# EAGLE design sbc_245 (EAGLE 9.2.0)

## Sheet 1 of 3
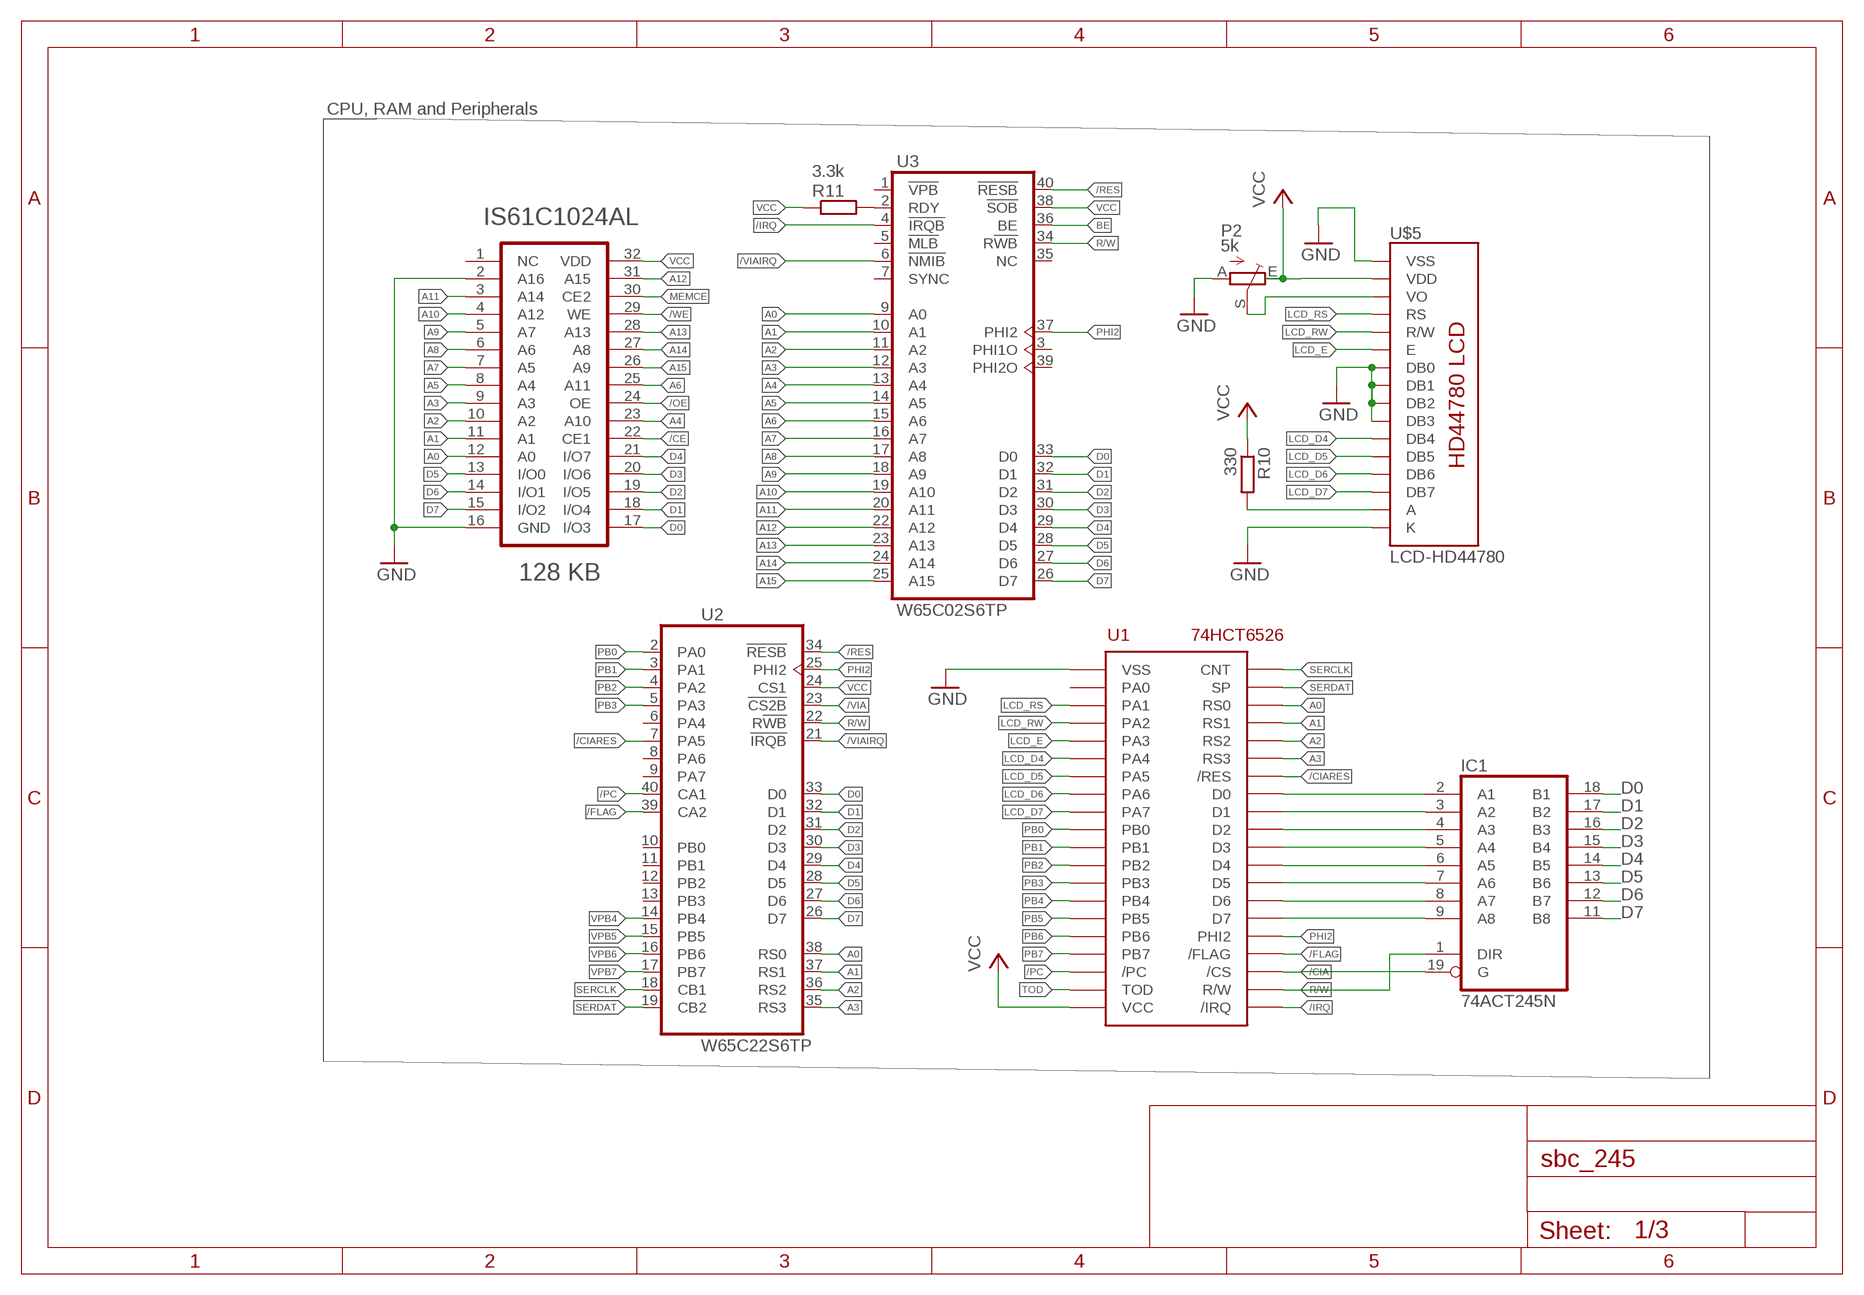
[diagram p0: schematic, sheet 1]

### Parts
IC1  74ACT245N  [DIL20]
P2  5k  TRIM_EU-B64Y  [B64Y]
R10  330  R-EU_R0805  [R0805]
R11  3.3k  R-EU_R0805  [R0805]
U1  74HCT6526  CIA40CIA_DIP  [DIP40]
U2  W65C22S6TP  [DIL40]
U3  W65C02S6TP  [DIL40]
U4  IS61C1024AL-12JLI-TR  IS61C1024AL  [SOJ32/3]
U$5  LCD-HD44780  [LCD-20X4-4HOLES2X8]

### Nets
/CE: U4.22(CE1) ; also sheet 2
/CIA: IC1.19(G) U1.23(/CS) ; also sheet 3
/CIARES: U1.34(/RES) U2.7(VIA:PA5)
/FLAG: U1.24(/FLAG) U2.39(VIA:CA2)
/IRQ: U1.21(/IRQ) U3.4(1:!IRQB)
/OE: U4.24(OE) ; also sheet 3
/PC: U1.18(/PC) U2.40(VIA:CA1)
/RES: U2.34(VIA:!RESB) U3.40(1:!RESB) ; also sheet 3
/VIA: U2.23(VIA:!CS2B) ; also sheet 3
/VIAIRQ: U2.21(VIA:!IRQB) U3.6(1:!NMIB)
/WE: U4.29(WE) ; also sheet 3
A0: U1.38(RS0) U2.38(VIA:RS0) U3.9(1:A0) U4.12(A0) ; also sheet 2
A1: U1.37(RS1) U2.37(VIA:RS1) U3.10(1:A1) U4.11(A1) ; also sheet 2
A2: U1.36(RS2) U2.36(VIA:RS2) U3.11(1:A2) U4.10(A2) ; also sheet 2
A3: U1.35(RS3) U2.35(VIA:RS3) U3.12(1:A3) U4.9(A3) ; also sheet 2
A4: U3.13(1:A4) U4.23(A10) ; also sheet 2
A5: U3.14(1:A5) U4.8(A4) ; also sheet 2
A6: U3.15(1:A6) U4.25(A11) ; also sheet 2
A7: U3.16(1:A7) U4.7(A5) ; also sheet 2
A8: U3.17(1:A8) U4.6(A6) ; also sheet 2
A9: U3.18(1:A9) U4.5(A7) ; also sheet 2
A10: U3.19(1:A10) U4.4(A12) ; also sheet 2
A11: U3.20(1:A11) U4.3(A14) ; also sheet 2,3
A12: U3.22(1:A12) U4.31(A15) ; also sheet 2,3
A13: U3.23(1:A13) U4.28(A13) ; also sheet 2,3
A14: U3.24(1:A14) U4.27(A8) ; also sheet 2,3
A15: U3.25(1:A15) U4.26(A9) ; also sheet 2,3
BE: U3.36(1:BE) ; also sheet 2
D0: IC1.18(B1) U2.33(VIA:D0) U3.33(1:D0) U4.17(I/O3) ; also sheet 2
D1: IC1.17(B2) U2.32(VIA:D1) U3.32(1:D1) U4.18(I/O4) ; also sheet 2
D2: IC1.16(B3) U2.31(VIA:D2) U3.31(1:D2) U4.19(I/O5) ; also sheet 2
D3: IC1.15(B4) U2.30(VIA:D3) U3.30(1:D3) U4.20(I/O6) ; also sheet 2
D4: IC1.14(B5) U2.29(VIA:D4) U3.29(1:D4) U4.21(I/O7) ; also sheet 2
D5: IC1.13(B6) U2.28(VIA:D5) U3.28(1:D5) U4.13(I/O0) ; also sheet 2
D6: IC1.12(B7) U2.27(VIA:D6) U3.27(1:D6) U4.14(I/O1) ; also sheet 2
D7: IC1.11(B8) U2.26(VIA:D7) U3.26(1:D7) U4.15(I/O2) ; also sheet 2
GND [power]: P2.A U1.1(VSS) U4.2(A16) U4.16(GND) U$5.P$1(VSS) U$5.P$7(DB0) U$5.P$8(DB1) U$5.P$9(DB2) U$5.P$10(DB3) U$5.P$16(K) ; also sheet 2,3
LCD_D4: U1.6(PA4) U$5.P$11(DB4)
LCD_D5: U1.7(PA5) U$5.P$12(DB5)
LCD_D6: U1.8(PA6) U$5.P$13(DB6)
LCD_D7: U1.9(PA7) U$5.P$14(DB7)
LCD_E: U1.5(PA3) U$5.P$6(E)
LCD_RS: U1.3(PA1) U$5.P$4(RS)
LCD_RW: U1.4(PA2) U$5.P$5(R/W)
LCDA: R10.2 U$5.P$15(A)
MEMCE: U4.30(CE2) ; also sheet 3
N$3: IC1.2(A1) U1.33(D0)
N$5: IC1.3(A2) U1.32(D1)
N$6: IC1.4(A3) U1.31(D2)
N$7: IC1.5(A4) U1.30(D3)
N$8: IC1.6(A5) U1.29(D4)
N$21: P2.S U$5.P$3(VO)
N$22: IC1.7(A6) U1.28(D5)
N$23: IC1.8(A7) U1.27(D6)
N$24: R11.2 U3.2(1:RDY)
N$27: IC1.9(A8) U1.26(D7)
PB0: U1.10(PB0) U2.2(VIA:PA0) ; also sheet 2
PB1: U1.11(PB1) U2.3(VIA:PA1) ; also sheet 2
PB2: U1.12(PB2) U2.4(VIA:PA2) ; also sheet 2
PB3: U1.13(PB3) U2.5(VIA:PA3) ; also sheet 2
PB4: U1.14(PB4) ; also sheet 2
PB5: U1.15(PB5) ; also sheet 2
PB6: U1.16(PB6) ; also sheet 2
PB7: U1.17(PB7) ; also sheet 2
PHI2: U1.25(PHI2) U2.25(VIA:PHI2) U3.37(1:PHI2) ; also sheet 2,3
R/W: IC1.1(DIR) U1.22(R/W) U2.22(VIA:R!WB) U3.34(1:R!WB) ; also sheet 2,3
SERCLK: U1.40(CNT) U2.18(VIA:CB1)
SERDAT: U1.39(SP) U2.19(VIA:CB2)
TOD: U1.19(TOD) ; also sheet 2
VCC [power]: P2.E R10.1 R11.1 U1.20(VCC) U2.24(VIA:CS1) U3.38(1:!SOB) U4.32(VDD) U$5.P$2(VDD) ; also sheet 2,3
VPB4: U2.14(VIA:PB4) ; also sheet 2
VPB5: U2.15(VIA:PB5) ; also sheet 2
VPB6: U2.16(VIA:PB6) ; also sheet 2
VPB7: U2.17(VIA:PB7) ; also sheet 2
Unconnected: U1.2(PA0) U2.6(VIA:PA4) U2.8(VIA:PA6) U2.9(VIA:PA7) U2.10(VIA:PB0) U2.11(VIA:PB1) U2.12(VIA:PB2) U2.13(VIA:PB3) U3.1(1:!VPB) U3.3(1:PHI1O) U3.5(1:!MLB) U3.7(1:SYNC) U3.35(1:NC) U3.39(1:PHI2O) U4.1(NC)

### Notes on the sheet
- CPU, RAM and Peripherals

## Sheet 2 of 3: Arduino Bootstrap
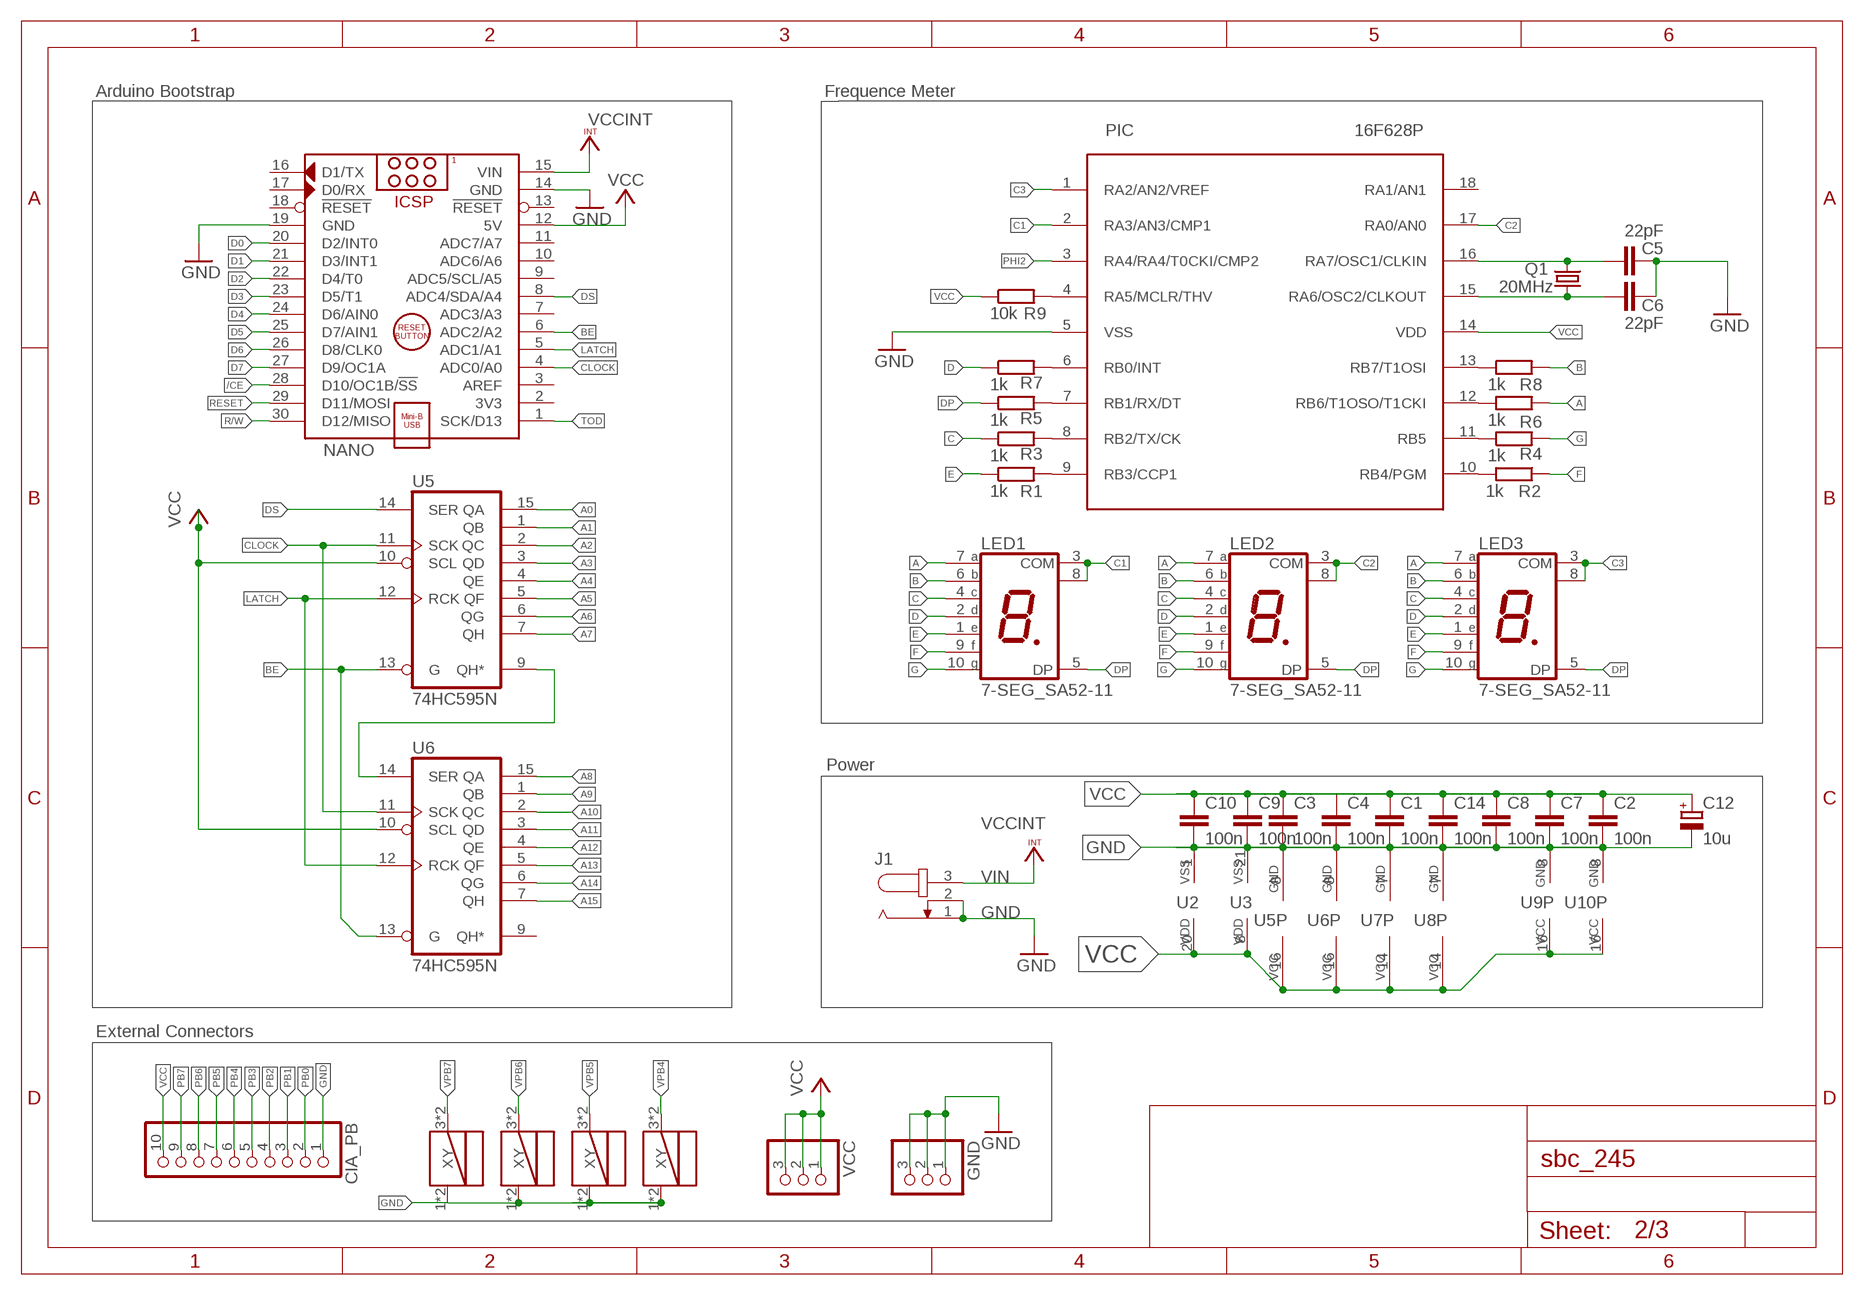
[diagram p1: schematic, sheet 2]

### Parts
C1  100n  C-EUC0805  [C0805]
C2  100n  C-EUC0805  [C0805]
C3  100n  C-EUC0805  [C0805]
C4  100n  C-EUC0805  [C0805]
C5  22pF  C-EU025-025X050  [C025-025X050]
C6  22pF  C-EU025-025X050  [C025-025X050]
C7  100n  C-EUC0805  [C0805]
C8  100n  C-EUC0805  [C0805]
C9  100n  C-EUC0805  [C0805]
C10  100n  C-EUC0805  [C0805]
C12  10u  CPOL-EUB45181A  [B45181A]
C14  100n  C-EUC0805  [C0805]
CIA_PB  PINHD-1X10  [1X10]
GND  PINHD-1X3  [1X03]
J1  JACK-PLUG0  [SPC4077]
LED1  7-SEG_SA52-11  [SA52-11]
LED2  7-SEG_SA52-11  [SA52-11]
LED3  7-SEG_SA52-11  [SA52-11]
NANO  ARDUINO_NANO  [ARDUINO_NANO]
PIC  16F628P  [DIL18]
Q1  20MHz  CRYSTALHC18U-V  [HC18U-V]
R1  1k  R-EU_0207/7  [0207/7]
R2  1k  R-EU_0207/7  [0207/7]
R3  1k  R-EU_0207/7  [0207/7]
R4  1k  R-EU_0207/7  [0207/7]
R5  1k  R-EU_0207/7  [0207/7]
R6  1k  R-EU_0207/7  [0207/7]
R7  1k  R-EU_0207/7  [0207/7]
R8  1k  R-EU_0207/7  [0207/7]
R9  10k  R-EU_R0805  [R0805]
U5  74HC595N  74LS595D  [SO16]
U6  74HC595N  74LS595D  [SO16]
U7  74AC74D  74LS74D  [SO14]
U8  74AC14D  7414D  [SO14]
U9  74AC139D  [SO16]
U10  74AC138D  [SO16]
U$1  TSA451G90-250  [TSA451G90-250]
U$2  TSA451G90-250  [TSA451G90-250]
U$3  TSA451G90-250  [TSA451G90-250]
U$4  TSA451G90-250  [TSA451G90-250]
VCC  PINHD-1X3  [1X03]

### Nets
/CE: NANO.28(D10/OC1B/!SS) ; also sheet 1
A [pic]: LED1.7(A) LED2.7(A) LED3.7(A) R6.2
A0: U5.15(QA) ; also sheet 1
A1: U5.1(QB) ; also sheet 1
A2: U5.2(QC) ; also sheet 1
A3: U5.3(QD) ; also sheet 1
A4: U5.4(QE) ; also sheet 1
A5: U5.5(QF) ; also sheet 1
A6: U5.6(QG) ; also sheet 1
A7: U5.7(QH) ; also sheet 1
A8: U6.15(QA) ; also sheet 1
A9: U6.1(QB) ; also sheet 1
A10: U6.2(QC) ; also sheet 1
A11: U6.3(QD) ; also sheet 1,3
A12: U6.4(QE) ; also sheet 1,3
A13: U6.5(QF) ; also sheet 1,3
A14: U6.6(QG) ; also sheet 1,3
A15: U6.7(QH) ; also sheet 1,3
B [pic]: LED1.6(B) LED2.6(B) LED3.6(B) R8.2
BE: NANO.6(ADC2/A2) U5.13(G) U6.13(G) ; also sheet 1
C [pic]: LED1.4(C) LED2.4(C) LED3.4(C) R3.1
C1 [pic]: LED1.3(COM) LED1.8(COM) PIC.2(RA3/AN3/CMP1)
C2 [pic]: LED2.3(COM) LED2.8(COM) PIC.17(RA0/AN0)
C3 [pic]: LED3.3(COM) LED3.8(COM) PIC.1(RA2/AN2/VREF)
CLOCK: NANO.4(ADC0/A0) U5.11(SCK) U6.11(SCK)
D [pic]: LED1.2(D) LED2.2(D) LED3.2(D) R7.1
D0: NANO.20(D2/INT0) ; also sheet 1
D1: NANO.21(D3/INT1) ; also sheet 1
D2: NANO.22(D4/T0) ; also sheet 1
D3: NANO.23(D5/T1) ; also sheet 1
D4: NANO.24(D6/AIN0) ; also sheet 1
D5: NANO.25(D7/AIN1) ; also sheet 1
D6: NANO.26(D8/CLK0) ; also sheet 1
D7: NANO.27(D9/OC1A) ; also sheet 1
DP [pic]: LED1.5(DP) LED2.5(DP) LED3.5(DP) R5.1
DS: NANO.8(ADC4/SDA/A4) U5.14(SER)
E [pic]: LED1.1(E) LED2.1(E) LED3.1(E) R1.1
F [pic]: LED1.9(F) LED2.9(F) LED3.9(F) R2.1
G [pic]: LED1.10(G) LED2.10(G) LED3.10(G) R4.2
GND [power]: C1.2 C2.2 C3.2 C4.2 C5.2 C6.2 C7.2 C8.2 C9.2 C10.2 C12.- C14.2 CIA_PB.1 GND.1 GND.2 GND.3 J1.1 J1.2 NANO.14(GND) NANO.19(GND) PIC.5(VSS) U2.1(VIAP:VSS) U3.21(P:VSS) U5.8(GND) U6.8(GND) U7.7(P:GND) U8.7(P:GND) U9.8(P:GND) U10.8(GND) U$1.1(X) U$1.2(X) U$2.1(X) U$2.2(X) U$3.1(X) U$3.2(X) U$4.1(X) U$4.2(X) ; also sheet 1,3
LATCH: NANO.5(ADC1/A1) U5.12(RCK) U6.12(RCK)
N$9: U5.9(QH*) U6.14(SER)
N$10: PIC.6(RB0/INT) R7.2
N$11: PIC.7(RB1/RX/DT) R5.2
N$12: PIC.8(RB2/TX/CK) R3.2
N$13: PIC.9(RB3/CCP1) R1.2
N$14: PIC.10(RB4/PGM) R2.2
N$15: PIC.11(RB5) R4.1
N$16: PIC.12(RB6/T1OSO/T1CKI) R6.1
N$17: PIC.13(RB7/T1OSI) R8.1
N$18: C5.1 PIC.16(RA7/OSC1/CLKIN) Q1.2
N$19: C6.1 PIC.15(RA6/OSC2/CLKOUT) Q1.1
N$20: PIC.4(RA5/MCLR/THV) R9.2
PB0: CIA_PB.2 ; also sheet 1
PB1: CIA_PB.3 ; also sheet 1
PB2: CIA_PB.4 ; also sheet 1
PB3: CIA_PB.5 ; also sheet 1
PB4: CIA_PB.6 ; also sheet 1
PB5: CIA_PB.7 ; also sheet 1
PB6: CIA_PB.8 ; also sheet 1
PB7: CIA_PB.9 ; also sheet 1
PHI2: PIC.3(RA4/RA4/T0CKI/CMP2) ; also sheet 1,3
R/W: NANO.30(D12/MISO) ; also sheet 1,3
RESET: NANO.29(D11/MOSI) ; also sheet 3
TOD: NANO.1(SCK/D13) ; also sheet 1
VCC [power]: C1.1 C2.1 C3.1 C4.1 C7.1 C8.1 C9.1 C10.1 C12.+ C14.1 CIA_PB.10 NANO.12(5V) PIC.14(VDD) R9.1 U2.20(VIAP:VDD) U3.8(P:VDD) U5.10(SCL) U5.16(VCC) U6.10(SCL) U6.16(VCC) U7.14(P:VCC) U8.14(P:VCC) U9.16(P:VCC) U10.16(VCC) VCC.1 VCC.2 VCC.3 ; also sheet 1,3
VIN: J1.3 NANO.15(VIN) ; supply symbol labelled VCCINT
VPB4: U$4.3(Y) U$4.4(Y) ; also sheet 1
VPB5: U$3.3(Y) U$3.4(Y) ; also sheet 1
VPB6: U$2.3(Y) U$2.4(Y) ; also sheet 1
VPB7: U$1.3(Y) U$1.4(Y) ; also sheet 1
Unconnected: NANO.2(3V3) NANO.3(AREF) NANO.7(ADC3/A3) NANO.9(ADC5/SCL/A5) NANO.10(ADC6/A6) NANO.11(ADC7/A7) NANO.13(!RESET) NANO.16(D1/TX) NANO.17(D0/RX) NANO.18(!RESET) PIC.18(RA1/AN1) U6.9(QH*)

### Notes on the sheet
- Arduino Bootstrap | Frequence Meter
- Power
- External Connectors

## Sheet 3 of 3: ADDR Decoder
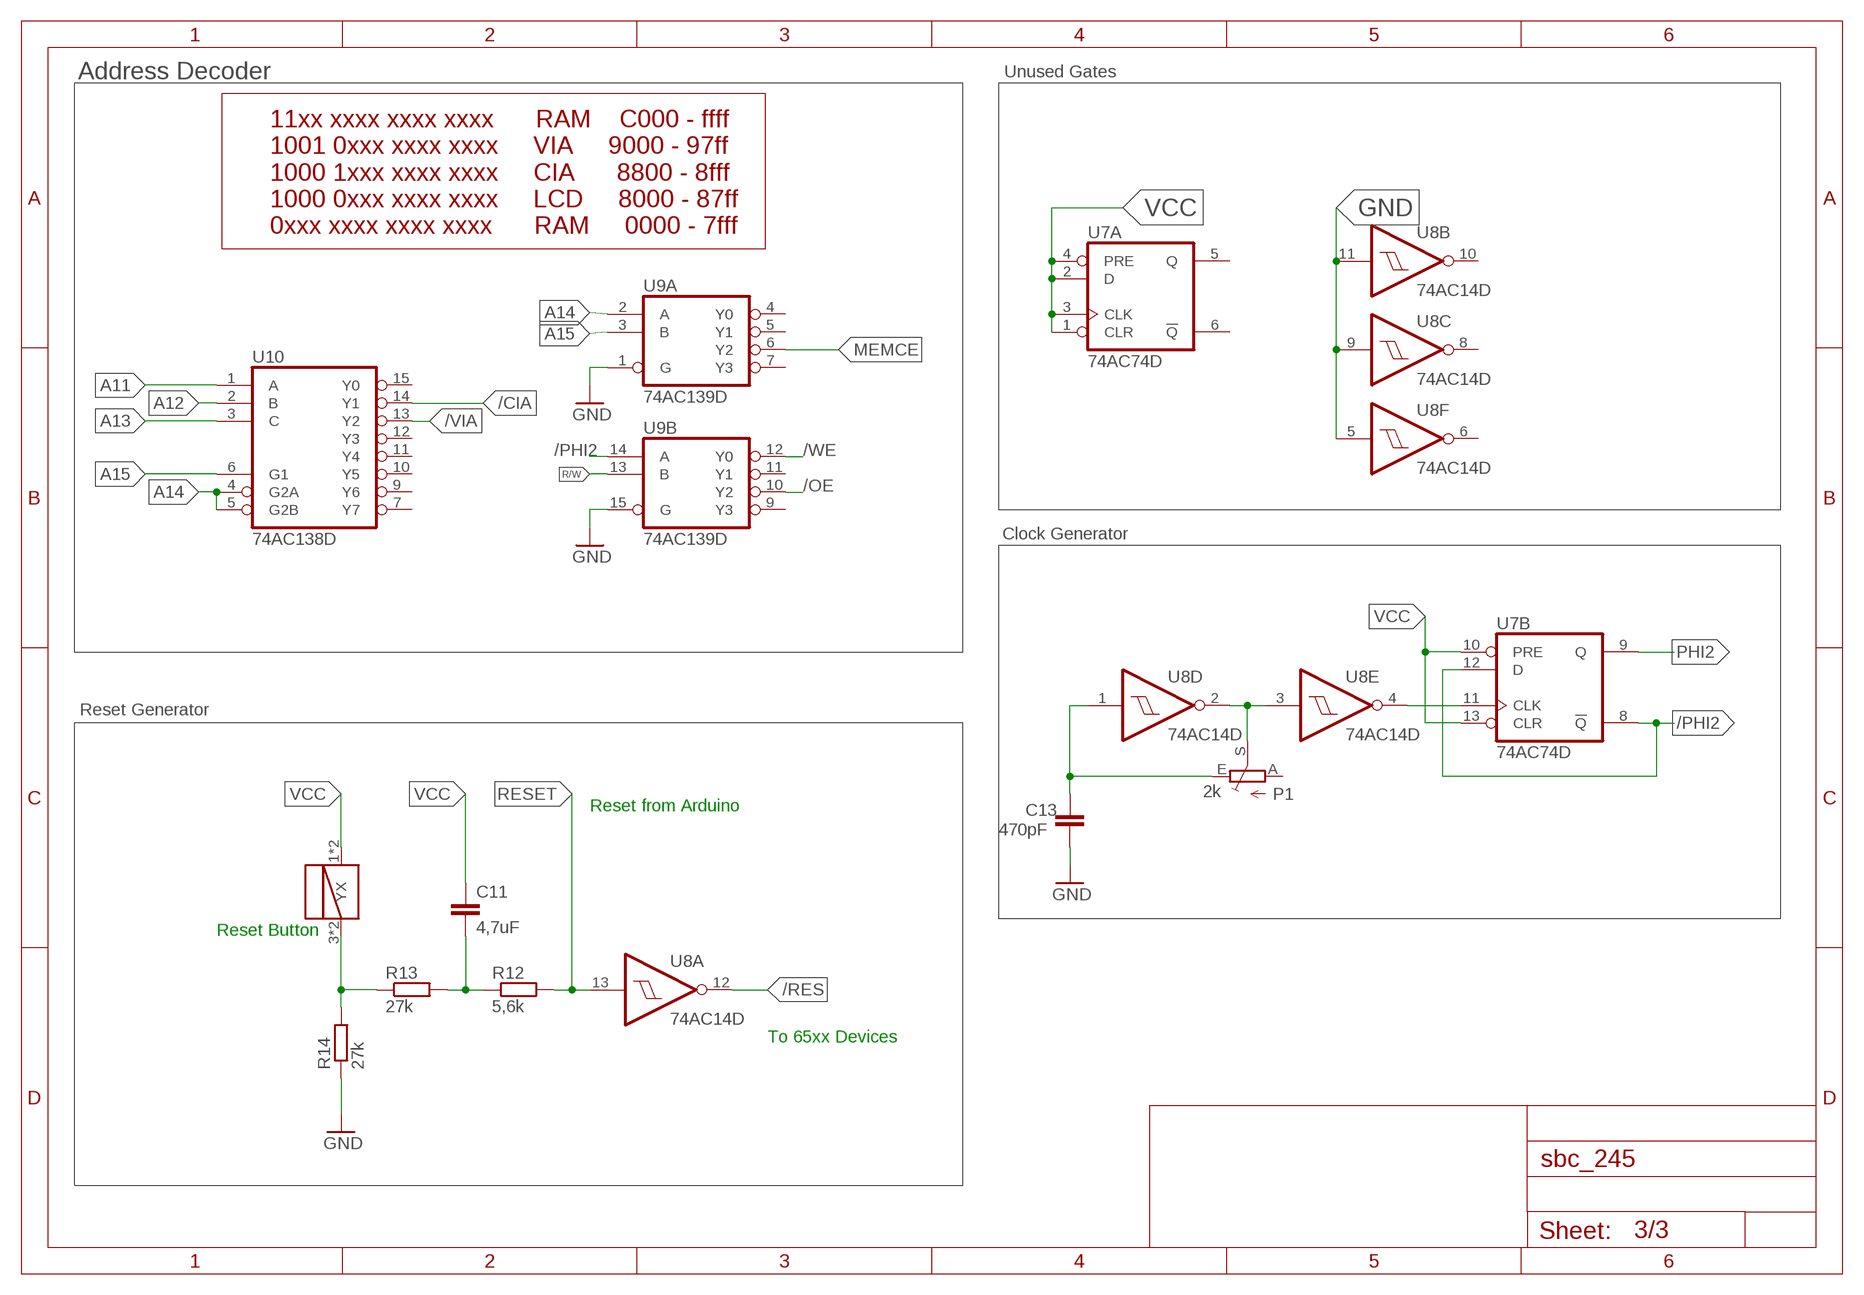
[diagram p2: schematic, sheet 3]

### Parts
C11  4,7uF  C-EUC0805  [C0805]
C13  470pF  C-EUC0805  [C0805]
P1  2k  TRIM_EU-B64Y  [B64Y]
R12  5,6k  R-EU_R0805  [R0805]
R13  27k  R-EU_R0805  [R0805]
R14  27k  R-EU_R0805  [R0805]
SW1  TSA451G90-250  [TSA451G90-250]

### Nets
/CIA: U10.14(Y1) ; also sheet 1
/OE: U9.10(B:Y2) ; also sheet 1
/PHI2: U7.8(B:!Q) U7.12(B:D) U9.14(B:A)
/RES: U8.12(A:O) ; also sheet 1
/VIA: U10.13(Y2) ; also sheet 1
/WE: U9.12(B:Y0) ; also sheet 1
A11: U10.1(A) ; also sheet 1,2
A12: U10.2(B) ; also sheet 1,2
A13: U10.3(C) ; also sheet 1,2
A14: U9.2(A:A) U10.4(G2A) U10.5(G2B) ; also sheet 1,2
A15: U9.3(A:B) U10.6(G1) ; also sheet 1,2
GND [power]: C13.2 R14.1 U8.5(F:I) U8.9(C:I) U8.11(B:I) U9.1(A:G) U9.15(B:G) ; also sheet 1,2
MEMCE: U9.6(A:Y2) ; also sheet 1
N$1: P1.S U8.2(D:O) U8.3(E:I)
N$2: U7.11(B:CLK) U8.4(E:O)
N$4: C13.1 P1.E U8.1(D:I)
N$25: R13.1 R14.2 SW1.3(Y) SW1.4(Y)
N$26: C11.2 R12.1 R13.2
PHI2: U7.9(B:Q) ; also sheet 1,2
R/W: U9.13(B:B) ; also sheet 1,2
RESET: R12.2 U8.13(A:I) ; also sheet 2
VCC [power]: C11.1 SW1.1(X) SW1.2(X) U7.1(A:CLR) U7.2(A:D) U7.3(A:CLK) U7.4(A:PRE) U7.10(B:PRE) U7.13(B:CLR) ; also sheet 1,2
Unconnected: P1.A U7.5(A:Q) U7.6(A:!Q) U8.6(F:O) U8.8(C:O) U8.10(B:O) U9.4(A:Y0) U9.5(A:Y1) U9.7(A:Y3) U9.9(B:Y3) U9.11(B:Y1) U10.7(Y7) U10.9(Y6) U10.10(Y5) U10.11(Y4) U10.12(Y3) U10.15(Y0)

### Notes on the sheet
- Address Decoder | Unused Gates
- 11xx xxxx xxxx xxxx      RAM    C000 - ffff
  1001 0xxx xxxx xxxx     VIA     9000 - 97ff
  1000 1xxx xxxx xxxx     CIA      8800 - 8fff
  1000 0xxx xxxx xxxx     LCD     8000 - 87ff
  0xxx xxxx xxxx xxxx      RAM     0000 - 7fff
- Clock Generator
- Reset Generator
- Reset from Arduino
- Reset Button
- To 65xx Devices

## Power pins joined to a net without a drawn wire
GND: IC1.10(GND)
VCC: IC1.20(VCC)

## Library data of the parts
C1-C11 C13 C14 = rcl:C-EU: CAPACITOR, European symbol; SPICEPREFIX: C
C12 = rcl:CPOL-EU: POLARIZED CAPACITOR, European symbol; SPICEPREFIX: C
CIA_PB = pinhead:PINHD-1X10: PIN HEADER
GND VCC = pinhead:PINHD-1X3: PIN HEADER
IC1 = 74xx-eu:74*245: Octal BUS TRANSCEIVER, 3-state
J1 = con-jack:JACK-PLUG: DC POWER JACK Power Jack, DC, Right Angle, Through Hole, Rated 5A at 16VDC, PC Terminals Distributor: Farnell (www.Farnell.de) Drawing: 84N1161.pdf / 84N1162.pdf Manufacturer: SPC Technology (www.spctechnology.com) Type: SPC4077 / SPC 4078; OC_FARNELL: unknown; OC_NEWARK: unknown
LED1-LED3 = display-kingbright:7-SEG_: Kingbright 14.2mm (0.56 INCH) SINGLE DIGIT NUMERIC DUISPLAY Source: SA56-11EWA(Ver1189471036.pdf; OC_FARNELL: unknown; OC_NEWARK: unknown
NANO = ArduinoNanoV30:ARDUINO_NANO: Arduino Nano V3.0 Module Overview: The Arduino Nano is a small, complete, and breadboard-friendly board based on the ATmega328 (Arduino Nano 3.x) or ATmega168 (Arduino Nano 2.x). It has more or less the same functionality of the Arduino Duemilanove, but in a different package. It lacks only a DC power jack, and works with a Mini-B USB cable instead of a standard one. The Nano was designed and is being produced by Gravitech <http://www.gravitech.us/arna30wiatp.html>. General specifications: Item Value Microcontroller Atmel ATmega168 or ATmega328 Operating Voltage (logic level) 5 V Input Voltage (recommended) 7-12 V Input Voltage (limits) 6-20 V Digital I/O Pins 14 (of which 6 provide PWM output) Analog Input Pins 8 DC Current per I/O Pin 40 mA Flash Memory 16 KB (ATmega168) or 32 KB (ATmega328) of which 2 KB used by bootloader SRAM 1 KB (ATmega168) or 2 KB (ATmega328) EEPROM 512 bytes (ATmega168) or 1 KB (ATmega328) Clock Speed 16 MHz Dimensions (Inches) 0.73" x 1.70" Dimensions (mm) 18mm x 45mm Overall height About 9 mm (not including pins) Weigth 5 g Power: The Arduino Nano can be powered via the Mini-B USB connection, 6-20V unregulated external power supply (pin 30), or 5V regulated external power supply (pin 27). The power source is automatically selected to the highest voltage source. Memory: The ATmega168 has 16 KB of flash memory for storing code (of which 2 KB is used for the bootloader); the ATmega328 has 32 KB, (also with 2 KB used for the bootloader). The ATmega168 has 1 KB of SRAM and 512 bytes of EEPROM (which can be read and written with the EEPROM library); the ATmega328 has 2 KB of SRAM and 1 KB of EEPROM. Input and Output: Each of the 14 digital pins on the Nano can be used as an input or output, using pinMode(), digitalWrite(), and digitalRead() functions. They operate at 5 volts. Each pin can provide or receive a maximum of 40 mA and has an internal pull-up resistor (disconnected by default) of 20-50 kOhms. In addition, some pins have specialized functions. Visit Arduino - ArduinoBoardNano <https://www.arduino.cc/en/Main/ArduinoBoardNano>
P1 P2 = pot:TRIM_EU-: POTENTIOMETER
PIC = osman-pic16f62x:16F62*: MicroChip 16F627/8(a) Pin compatible devices: PIC16F627, PIC16F627A, PIC16F628, PIC16F628A
Q1 = crystal:CRYSTAL: CRYSTAL; OC_FARNELL: unknown; OC_NEWARK: unknown
R1-R14 = rcl:R-EU_: RESISTOR, European symbol; SPICEPREFIX: R
SW1 U$1-U$4 = DMG_switches-2:TSA451G90-250
U1 = DMG_cia40:CIA40
U2 = DMG_6502:W65C22S: W65C22 by WDC
U3 = DMG_6502:W65C02S: W65C02 by WDC
U4 = is61c1024al:IS61C1024AL
U5 U6 = 74xx-us:74*595: 8-bit SHIFT REGISTER, output latch
U7 = 74xx-us:74*74: Dual D type positive edge triggered FLIP FLOP, preset and clear
U8 = 74xx-us:74*14: Hex schmitt trigger INVERTER
U9 = 74xx-eu:74*139: Dual 2-line to 4-line DECODER/DEMULTIPLEXER
U10 = 74xx-eu:74*138: 3-line to 8-line DECODER/DEMULTIPLEXER
U$5 = HD44780LCD:LCD-HD44780

## Net classes
1 power: width 0.254 mm

## Board
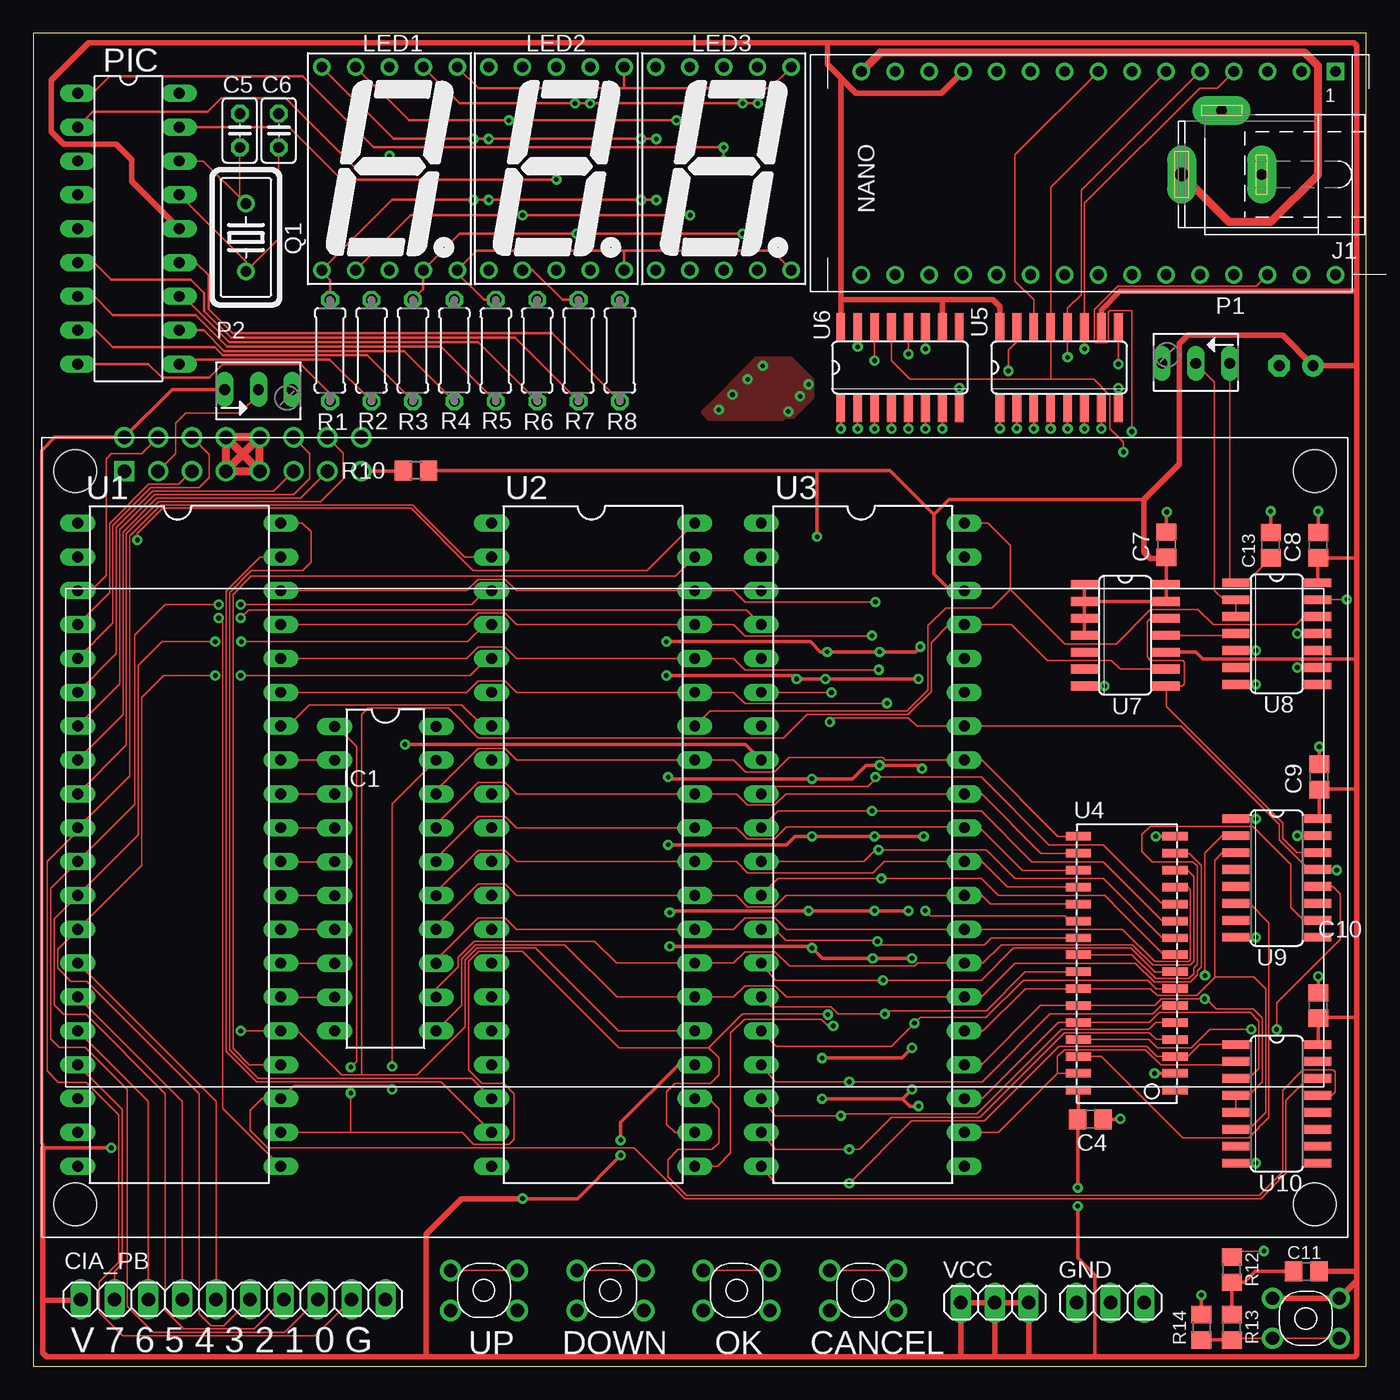
[diagram p3: board, top side]
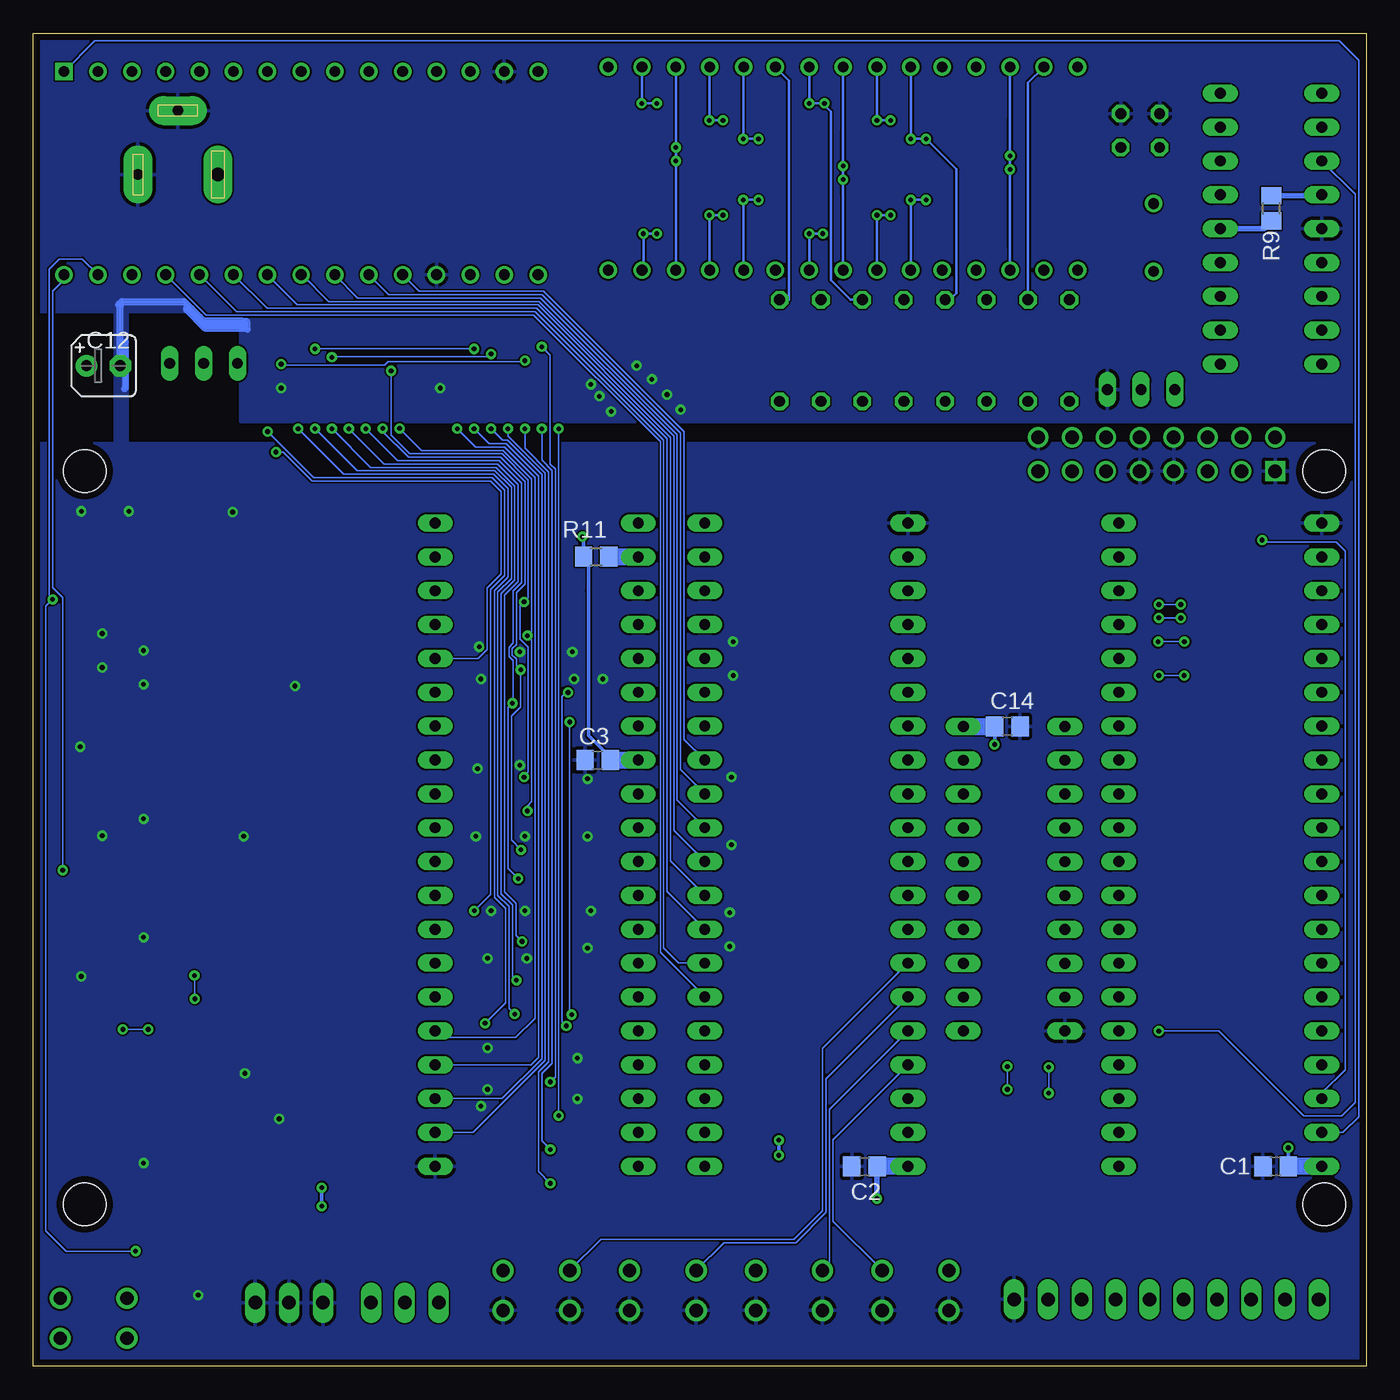
[diagram p4: board, bottom side, seen from below]

Size 100 x 100 mm. Coordinates in mm from the lower left corner, seen from the top.
Outline: 0,0 100,0 100,100 0,100 0,0
Copper layers (1*16): Top 0.035mm / dielectric 1.5mm / Bottom 0.035mm
Design rules "default *": minimum track width 5mil, minimum drill 0.35mm, track to track 5mil, track to pad 5mil, pad to pad 5mil, via to via 5mil, smd to smd 0mil, copper to edge 20mil, drill to drill 6mil, minimum pad ring 10mil, minimum via ring 8mil, stop-mask expansion 4mil, vias tented up to drill 0mil, thermal gap 10mil

### Footprints (pad centres in the part's own frame; a part is rotated, then mirrored left to right if it is on the bottom)
C0805 = smd 1.3 x 1.5: 1 -0.95,0; 2 0.95,0
C025-025X050 = drill 0.813 octagon: 1 -1.27,0; 2 1.27,0
B45181A = drill 0.813 pad 1.6: + -1.27,0 | drill 0.813 pad 1.6 octagon: - 1.27,0
1X10 = drill 1.016 long: 1 -11.43,0; 2 -8.89,0; 3 -6.35,0; 4 -3.81,0; 5 -1.27,0; 6 1.27,0; 7 3.81,0; 8 6.35,0; 9 8.89,0; 10 11.43,0
1X03 = drill 1.016 long: 1 -2.54,0; 2 0,0; 3 2.54,0
DIL20 = drill 0.813 long: 1 -11.43,-3.81; 2 -8.89,-3.81; 3 -6.35,-3.81; 4 -3.81,-3.81; 5 -1.27,-3.81; 6 1.27,-3.81; 7 3.81,-3.81; 8 6.35,-3.81; 9 8.89,-3.81; 10 11.43,-3.81; 11 11.43,3.81; 12 8.89,3.81; 13 6.35,3.81; 14 3.81,3.81; 15 1.27,3.81; 16 -1.27,3.81; 17 -3.81,3.81; 18 -6.35,3.81; 19 -8.89,3.81; 20 -11.43,3.81
SPC4077 = drill 0.8 pad 2.184 long: 1 -3,0; 2 0,-4.8 | drill 1 pad 2.184 long: 3 3,0
SA52-11 = drill 0.8: 1 -5.08,-7.62; 2 -2.54,-7.62; 3 0,-7.62; 4 2.54,-7.62; 5 5.08,-7.62; 6 5.08,7.62; 7 2.54,7.62; 8 0,7.62; 9 -2.54,7.62; 10 -5.08,7.62
ARDUINO_NANO = drill 0.8 square: 1 -20.32,-7.62 | drill 0.8: 2 -17.78,-7.62; 3 -15.24,-7.62; 4 -12.7,-7.62; 5 -10.16,-7.62; 6 -7.62,-7.62; 7 -5.08,-7.62; 8 -2.54,-7.62; 9 0,-7.62; 10 2.54,-7.62; 11 5.08,-7.62; 12 7.62,-7.62; 13 10.16,-7.62; 14 12.7,-7.62; 15 15.24,-7.62; 16 15.24,7.62; 17 12.7,7.62; 18 10.16,7.62; 19 7.62,7.62; 20 5.08,7.62; 21 2.54,7.62; 22 0,7.62; 23 -2.54,7.62; 24 -5.08,7.62; 25 -7.62,7.62; 26 -10.16,7.62; 27 -12.7,7.62; 28 -15.24,7.62; 29 -17.78,7.62; 30 -20.32,7.62
B64Y = drill 0.813 long: A 2.54,0; E -2.54,0; S 0,0
DIL18 = drill 0.813 long: 1 -10.16,-3.81; 2 -7.62,-3.81; 3 -5.08,-3.81; 4 -2.54,-3.81; 5 0,-3.81; 6 2.54,-3.81; 7 5.08,-3.81; 8 7.62,-3.81; 9 10.16,-3.81; 10 10.16,3.81; 11 7.62,3.81; 12 5.08,3.81; 13 2.54,3.81; 14 0,3.81; 15 -2.54,3.81; 16 -5.08,3.81; 17 -7.62,3.81; 18 -10.16,3.81
HC18U-V = drill 0.813: 1 -2.54,0; 2 2.54,0
0207/7 = drill 0.813 octagon: 1 -3.81,0; 2 3.81,0
R0805 = smd 1.3 x 1.5: 1 -0.95,0; 2 0.95,0
TSA451G90-250 = drill 1 pad 1.6: 1 -2.523,1.539; 2 2.477,1.539; 3 -2.523,-1.461; 4 2.477,-1.461
DIP40 = drill 0.813 long: 1 -24.13,-7.62; 2 -21.59,-7.62; 3 -19.05,-7.62; 4 -16.51,-7.62; 5 -13.97,-7.62; 6 -11.43,-7.62; 7 -8.89,-7.62; 8 -6.35,-7.62; 9 -3.81,-7.62; 10 -1.27,-7.62; 11 1.27,-7.62; 12 3.81,-7.62; 13 6.35,-7.62; 14 8.89,-7.62; 15 11.43,-7.62; 16 13.97,-7.62; 17 16.51,-7.62; 18 19.05,-7.62; 19 21.59,-7.62; 20 24.13,-7.62; 21 24.13,7.62; 22 21.59,7.62; 23 19.05,7.62; 24 16.51,7.62; 25 13.97,7.62; 26 11.43,7.62; 27 8.89,7.62; 28 6.35,7.62; 29 3.81,7.62; 30 1.27,7.62; 31 -1.27,7.62; 32 -3.81,7.62; 33 -6.35,7.62; 34 -8.89,7.62; 35 -11.43,7.62; 36 -13.97,7.62; 37 -16.51,7.62; 38 -19.05,7.62; 39 -21.59,7.62; 40 -24.13,7.62
DIL40 = drill 0.813 long: 1 -24.13,-7.62; 2 -21.59,-7.62; 3 -19.05,-7.62; 4 -16.51,-7.62; 5 -13.97,-7.62; 6 -11.43,-7.62; 7 -8.89,-7.62; 8 -6.35,-7.62; 9 -3.81,-7.62; 10 -1.27,-7.62; 11 1.27,-7.62; 12 3.81,-7.62; 13 6.35,-7.62; 14 8.89,-7.62; 15 11.43,-7.62; 16 13.97,-7.62; 17 16.51,-7.62; 18 19.05,-7.62; 19 21.59,-7.62; 20 24.13,-7.62; 21 24.13,7.62; 22 21.59,7.62; 23 19.05,7.62; 24 16.51,7.62; 25 13.97,7.62; 26 11.43,7.62; 27 8.89,7.62; 28 6.35,7.62; 29 3.81,7.62; 30 1.27,7.62; 31 -1.27,7.62; 32 -3.81,7.62; 33 -6.35,7.62; 34 -8.89,7.62; 35 -11.43,7.62; 36 -13.97,7.62; 37 -16.51,7.62; 38 -19.05,7.62; 39 -21.59,7.62; 40 -24.13,7.62
SOJ32/3 = smd 0.635 x 1.905: 1 -8.89,-3.759; 2 -7.62,-3.759; 3 -6.35,-3.759; 4 -5.08,-3.759; 5 -3.81,-3.759; 6 -2.54,-3.759; 7 -1.27,-3.759; 8 0,-3.759; 9 1.27,-3.759; 10 2.54,-3.759; 11 3.81,-3.759; 12 5.08,-3.759; 13 6.35,-3.759; 14 7.62,-3.759; 15 8.89,-3.759; 16 10.16,-3.759; 17 10.16,3.505; 18 8.89,3.505; 19 7.62,3.505; 20 6.35,3.505; 21 5.08,3.505; 22 3.81,3.505; 23 2.54,3.505; 24 1.27,3.505; 25 0,3.505; 26 -1.27,3.505; 27 -2.54,3.505; 28 -3.81,3.505; 29 -5.08,3.505; 30 -6.35,3.505; 31 -7.62,3.505; 32 -8.89,3.505
SO16 = smd 0.66 x 2.032: 1 -4.445,-3.073; 2 -3.175,-3.073; 3 -1.905,-3.073; 4 -0.635,-3.073; 5 0.635,-3.073; 6 1.905,-3.073; 7 3.175,-3.073; 8 4.445,-3.073; 9 4.445,3.073; 10 3.175,3.073; 11 1.905,3.073; 12 0.635,3.073; 13 -0.635,3.073; 14 -1.905,3.073; 15 -3.175,3.073; 16 -4.445,3.073
SO14 = smd 0.66 x 2.032: 1 -3.81,-3.073; 2 -2.54,-3.073; 3 -1.27,-3.073; 4 0,-3.073; 5 1.27,-3.073; 6 2.54,-3.073; 7 3.81,-3.073; 8 3.81,3.073; 9 2.54,3.073; 10 1.27,3.073; 11 0,3.073; 12 -1.27,3.073; 13 -2.54,3.073; 14 -3.81,3.073
LCD-20X4-4HOLES2X8 = drill 1.016 square: P$1 6.19,57.5 | drill 1.016: P$2 6.19,60.04; P$3 8.73,57.5; P$4 8.73,60.04; P$5 11.27,57.5; P$6 11.27,60.04; P$7 13.81,57.5; P$8 13.81,60.04; P$9 16.35,57.5; P$10 16.35,60.04; P$11 18.89,57.5; P$12 18.89,60.04; P$13 21.43,57.5; P$14 21.43,60.04; P$15 23.97,57.5; P$16 23.97,60.04 | hole 3.2: 2.5,2.5; 2.5,57.5; 95.5,57.5; 95.5,2.5

### Placement (x,y rotation side)
C1  6.8,15 180 bottom
C2  37.64,14.99 180 bottom
C3  57.66,45.47 180 bottom
C4  79.31,18.54 0 top
C5  15.49,92.71 90 top
C6  18.41,92.71 90 top
C7  85.02,61.63 90 top
C8  96.39,61.59 90 top
C9  96.47,44.21 90 top
C10  96.39,27.05 90 top
C11  95.5,7.11 180 top
C12  94.74,75.06 0 bottom
C13  92.84,61.59 90 top
C14  26.92,48.01 0 bottom
CIA_PB  14.99,5.02 180 top
GND  80.81,4.76 0 top
IC1  26.42,36.58 270 top
J1  89.15,89.41 180 top
LED1  26.72,89.85 0 top
LED2  39.24,89.85 0 top
LED3  51.79,89.85 0 top
NANO  77.37,89.51 180 top
P1  87.22,75.23 180 top
P2  16.89,73.28 0 top
PIC  7.14,85.34 270 top
Q1  15.95,84.68 90 top
R1  22.27,76.2 270 top
R2  25.37,76.2 270 top
R3  28.48,76.2 270 top
R4  31.59,76.2 90 top
R5  34.69,76.2 270 top
R6  37.8,76.2 90 top
R7  40.9,76.2 270 top
R8  44.01,76.2 90 top
R9  7.11,86.87 90 bottom
R10  28.7,67.18 180 top
R11  57.77,60.73 0 bottom
R12  89.92,7.24 90 top
R13  89.92,2.92 90 top
R14  87.63,2.92 270 top
SW1  95.5,3.56 0 top
U1  10.95,39.13 270 top
U2  42,39.13 270 top
U3  62.23,39.13 270 top
U4  81.92,29.59 90 top
U5  76.96,74.93 0 top
U6  65.02,74.93 0 top
U7  81.92,54.84 270 top
U8  93.28,54.96 270 top
U9  93.28,36.63 270 top
U10  93.28,19.68 270 top
U$1  33.78,5.71 180 top
U$2  43.26,5.71 180 top
U$3  52.75,5.71 180 top
U$4  62.23,5.71 180 top
U$5  0.64,9.65 0 top
VCC  72.13,4.76 0 top

### Tracks (layer width: path | path; a pad name or v marks a point on that pad's centre or on a via)
/CE  (via drill 0.35)
  Top 0.127: U4.22 77.78,33.4 77.39,33.78 71.37,33.78 67.3,33.78 v66.92,34.16 | NANO.28 91.76,81.04 81.37,81.04 79.62,79.28 79.62,76.91 79.73,76.8 80.55,76.8 80.66,76.91 80.66,79.1 80.77,79.21 82.42,79.21 v82.42,70.12
  Bottom 0.127: v66.92,34.16 65.68,35.41 65.68,58.27 64.64,59.3 64.64,65.73 65.59,66.67 78.98,66.67 v82.42,70.12
/CIA  (via drill 0.35)
  Top 0.127: 48.9,12.57 49.53,12.57 | 49.53,12.57 92.08,12.57 93.98,14.48 93.98,19.94 95.63,21.59 U10.14 | IC1.19 26.92,42.16 v26.92,22.48 | v26.92,20.77 26.61,21.08 19.57,21.08 U1.23 17.16,20.08 16.26,19.18 16.26,17.7 17.57,16.38 35.79,16.38 45.09,16.38 48.9,12.57 | 48.9,12.57 49.53,12.57
  Bottom 0.127: v26.92,22.48 v26.92,20.77
/CIARES
  Top 0.127: U2.7 33.73,48.02 32.13,49.62 20.7,49.62 19.1,48.02 U1.34
/FLAG
  Top 0.127: U1.24 16.2,22.62 14.99,23.83 14.99,57.91 16.36,59.28 48.19,59.28 U2.39
/IRQ  (via drill 0.35)
  Top 0.127: U1.21 14.22,19.34 14.22,55.82 v13.91,56.13 | v15.56,56.14 16.16,56.74 53.51,56.74 U3.4
  Bottom 0.127: v15.56,56.14 v15.55,56.13 v13.91,56.13
/OE
  Top 0.127: U4.24 82.42,30.86 84.2,29.08 86.71,29.08 87.07,29.45 87.07,29.87 87.33,30.13 87.33,37.52 87,37.85 83.95,37.85 83.19,38.61 83.19,39.88 83.81,40.5 91.49,40.5 94.36,37.63 94.36,34.42 95.33,33.45 U9.10
/PC  (via drill 0.35)
  Top 0.127: U2.40 46.06,59.69 33.01,59.69 28.33,64.36 9.71,64.36 7.81,62.46 v7.81,61.98
  Bottom 0.127: U1.18 3.33,20.49 1.57,22.25 1.57,61.17 2.23,61.83 7.66,61.83 v7.81,61.98
/PHI2
  Top 0.127: U7.12 83.79,56.11 83.57,55.88 83.57,53.21 83.82,52.96 86.23,52.96 86.36,52.83 86.36,51.18 86.2,51.03 U7.8 84.99,49.51 93.73,40.77 93.73,39.6 94.8,38.53 U9.14
/RES
  Top 0.127: U3.40 70.1,63.26 71.63,63.26 73.31,61.58 73.31,58.27 | U8.12 95.35,56.23 94.74,55.63 88.52,55.63 87.38,56.77 83.82,56.77 81.24,54.19 77.38,54.19 73.31,58.27 | U2.34 50.75,49.15 65.53,49.15 67.12,50.73 67.12,55.56 68.45,56.9 71.94,56.9 73.31,58.27
/VIA
  Top 0.127: U10.13 97.41,20.32 97.66,20.57 97.66,22.1 97.54,22.23 95.25,22.23 93.73,20.7 93.73,14.58 91.97,12.83 49.02,12.83 47.62,14.22 47.62,15.49 48.39,16.26 50.93,16.26 51.44,16.76 51.44,19.3 50.66,20.08 U2.23
/VIAIRQ  (via drill 0.35)
  Top 0.127: U2.21 51.32,15 52.32,16 52.32,25.02 53.34,26.04 59.14,26.04 59.62,25.55 59.99,25.55 v60.01,25.53 | v59.88,50.55 v59.87,50.56 U3.6
  Bottom 0.127: v60.01,25.53 60.33,25.84 60.33,50.23 60.01,50.55 v59.88,50.55
/WE  (via drill 0.35)
  Top 0.127: U4.29 83.69,24.51 84.2,24 84.33,23.88 86.23,23.88 86.87,23.88 88.27,25.27 v91.38,25.27 | v93.28,25.27 93.28,27.24 98.04,32 98.04,35.43 97.49,35.99 U9.12
  Bottom 0.127: v91.38,25.27 v93.28,25.27
A  (via drill 0.35)
  Top 0.203: LED1.7 31.99,94.74 34.16,94.74 | 34.16,94.74 v40.64,94.74 | v41.78,94.74 v53.21,94.74 | v54.36,94.74 34.16,94.74
  Bottom 0.203: LED3.7 54.33,94.77 v54.36,94.74 v53.21,94.74 | LED2.7 v41.78,94.74 40.77,94.74 | 40.77,94.74 v40.64,94.74 | 40.77,94.74 40.16,94.14 40.16,81.48 38.69,80.01 R6.2
A0  (via drill 0.35)
  Top 0.127: U1.38 32.52,58.18 33.37,59.03 35.4,59.03 36.25,58.18 U2.38 52.53,58.18 53.38,57.33 63.17,57.33 v63.18,57.34 | U5.15 73.79,76.86 73.15,76.22 v73.15,74.68 | U4.12 84.71,34.67 81.66,37.72 80.26,39.12 76.2,39.12 71.12,44.2 v63.18,44.2 63.18,44.06 62.62,43.5 55.17,43.5 U3.9
  Bottom 0.127: v73.15,74.68 73.15,69.85 71.75,68.45 64.85,68.45 62.87,66.47 62.87,57.66 v63.18,57.34 63.49,57.03 63.49,54.57 62.87,53.94 62.87,44.58 63.18,44.26 v63.18,44.2
A1  (via drill 0.35)
  Top 0.127: U1.37 32.52,55.64 33.37,56.49 35.4,56.49 36.25,55.64 U2.37 52.53,55.64 53.38,54.79 62.91,54.79 v62.93,54.81 | U4.11 84.71,33.4 80.26,37.85 74.93,37.85 71.12,41.66 v62.93,41.66 55.87,41.66 U3.10 | v72.52,70.36 U5.1
  Bottom 0.127: v72.52,70.36 70.87,68.71 64.74,68.71 62.61,66.57 62.61,55.12 v62.93,54.81 62.61,54.49 62.61,42.35 62.93,42.04 v62.93,41.66
A2  (via drill 0.35)
  Top 0.127: U1.36 32.52,53.1 33.37,53.95 35.4,53.95 36.25,53.1 U2.36 52.53,53.1 53.38,52.25 v63.43,52.25 | U4.10 85.55,32 84.84,32 80.26,36.58 73.66,36.58 71.49,38.74 v63.41,38.74 63.2,38.74 62.31,37.86 U3.11 | v73.79,70.36 U5.2
  Bottom 0.127: v73.79,70.36 73.79,70.13 71.86,68.2 64.95,68.2 63.12,66.36 63.12,58.67 63.75,58.04 63.75,54.14 64.07,53.83 64.07,53.36 63.75,53.04 63.75,52.57 v63.43,52.25 63.46,52.23 63.46,49.47 64.14,48.8 64.14,39.47 v63.41,38.74
A3  (via drill 0.35)
  Top 0.127: U1.35 32.52,50.56 33.37,51.41 35.4,51.41 36.25,50.56 U2.35 52.53,50.56 53.38,49.71 64.03,49.71 v64.06,49.74 | U5.3 v75.06,70.33 | U4.9 84.84,30.86 81.72,33.97 80.39,35.31 72.42,35.31 71.14,36.59 v63.62,36.59 55.88,36.59 U3.12
  Bottom 0.127: v75.06,70.33 72.67,67.94 65.06,67.94 63.37,66.26 63.37,58.78 64.01,58.14 64.01,54.25 64.32,53.94 64.32,53.25 64.01,52.94 64.01,49.79 v64.06,49.74 64.39,49.41 64.39,37.36 v63.62,36.59
A4  (via drill 0.35)
  Top 0.127: U5.4 v76.33,70.33 | U4.23 71.88,32.13 71.36,31.61 63.59,31.61 v63.33,31.86 63.26,31.94 56.47,31.94 55.63,32.78 U3.13
  Bottom 0.127: v76.33,70.33 73.68,67.69 65.17,67.69 63.63,66.15 63.63,58.88 64.64,57.87 64.64,35.57 63.8,34.73 63.8,32.33 v63.33,31.86
A5  (via drill 0.35)
  Top 0.127: U5.5 v77.6,70.33 | U3.14 55.67,28.96 v63.75,28.96 71.12,28.96 73.53,31.37 82.35,31.37 84.13,29.59 U4.8
  Bottom 0.127: v77.6,70.33 74.7,67.44 65.27,67.44 63.88,66.05 63.88,58.99 64.9,57.97 64.9,35.44 64.05,34.59 64.05,29.25 v63.75,28.96
A6  (via drill 0.35)
  Top 0.127: U5.6 v78.87,70.33 | U4.25 74.41,29.59 71.49,26.67 64.14,26.67 v63.88,26.42 60.37,26.42 59.84,26.94 55.37,26.94 U3.15
  Bottom 0.127: v78.87,70.33 75.72,67.18 65.38,67.18 64.14,65.94 64.14,59.09 65.15,58.08 65.15,35.31 64.32,34.48 64.32,26.86 v63.88,26.42
A7  (via drill 0.35)
  Top 0.127: U3.16 55.77,24 64.39,24 66.1,25.72 v66.1,25.73 66.54,26.16 71.47,26.16 74.26,28.96 83.61,28.96 84.25,28.32 U4.7 | U5.7 v80.14,70.33
  Bottom 0.127: v80.14,70.33 76.73,66.93 65.48,66.93 64.39,65.84 64.39,59.2 65.41,58.18 65.41,35.17 64.58,34.34 64.58,27.25 v66.1,25.73
A8  (via drill 0.35)
  Top 0.127: U3.17 55.67,21.34 v61.21,21.34 71.2,21.34 76.28,26.42 83.99,26.42 84.63,27.05 U4.6 | U6.15 v61.85,76.48
  Bottom 0.127: v61.85,76.48 61.21,75.85 61.21,67.69 60.83,67.31 60.83,21.72 v61.21,21.34
A9  (via drill 0.35)
  Top 0.127: U3.18 55.67,18.8 v60.58,18.8 60.71,18.92 70.78,18.92 77.13,25.27 83.69,25.27 84.2,25.78 U4.5 | U6.1 v60.58,70.33
  Bottom 0.127: v60.58,70.33 v60.58,18.8
A10  (via drill 0.35)
  Top 0.127: U3.19 55.67,16.26 v61.21,16.26 61.98,16.26 64.39,18.67 71.02,18.67 77.36,25.02 83.73,25.02 84.24,24.51 U4.4 | U6.2 v61.85,70.33
  Bottom 0.127: v61.85,70.33 61.85,67.97 61.09,67.2 61.09,22.73 61.85,21.97 61.85,16.89 v61.21,16.26
A11  (via drill 0.35)
  Top 0.127: U3.20 55.67,13.72 v61.21,13.72 65.89,18.39 71.35,18.39 76.96,24 83.54,24 84.31,23.24 85.85,23.24 | U6.3 v63.12,70.33 | U10.1 87.5,24.13 86.61,23.24 86.49,23.24 85.85,23.24 | U4.3 85.85,23.24
  Bottom 0.127: v63.12,70.33 63.12,68.88 61.34,67.1 61.34,22.84 62.1,22.08 62.1,14.61 v61.21,13.72
A12  (via drill 0.35)
  Top 0.127: U3.22 72.4,17.54 76.83,21.97 | U4.31 76.83,21.97 | U6.4 v64.39,70.33 | 76.83,21.97 76.83,23.24 77.34,23.75 83.44,23.75 84.58,22.61 89.95,22.61 U10.2
  Bottom 0.127: v64.39,70.33 64.39,69.79 61.59,66.99 61.59,22.94 67,17.54 U3.22
A13  (via drill 0.35)
  Top 0.127: U6.5 v65.66,70.33 | U10.3 91.19,21.59 91.95,22.35 91.95,25.89 91.29,26.54 84.48,26.54 83.72,25.78 78.23,25.78 | U4.28 78.23,25.78 | U3.23 71.2,20.08 76.9,25.78 78.23,25.78
  Bottom 0.127: v65.66,70.33 64.79,69.47 64.43,69.47 61.85,66.89 61.85,23.05 64.82,20.08 U3.23
A14  (via drill 0.35)
  Top 0.127: U3.24 71.13,22.62 75.56,27.05 U4.27 84.14,27.05 84.64,27.56 87.1,27.56 v87.88,27.56 88.01,27.56 88.77,26.8 91.52,26.8 92.2,26.12 92.2,21.34 91.19,20.32 90.3,20.32 U10.4 U10.5 | U6.6 v66.93,70.33 | U9.2 89.2,39.8 87.91,38.51 v87.91,29.3
  Bottom 0.127: v66.93,70.33 65.81,69.22 64.53,69.22 62.1,66.78 62.1,23.15 62.64,22.62 U3.24 | v87.91,29.3 87.91,27.58 v87.88,27.56
A15  (via drill 0.35)
  Top 0.127: U6.7 v68.2,70.33 | U9.3 89.2,38.53 88.63,37.96 88.63,29.21 | 88.63,29.21 88.63,29.16 87.29,27.81 84.33,27.81 83.82,28.32 U4.26 74.42,28.32 71.26,25.16 U3.25 | U10.6 91.19,17.78 92.46,19.05 92.46,28.32 91.57,29.21 88.63,29.21
  Bottom 0.127: v68.2,70.33 66.83,68.96 64.64,68.96 62.36,66.68 62.36,26.1 63.8,24.65 69.34,24.65 U3.25
B
  Top 0.203: LED1.6 33.39,95.89 44.2,95.89 44.32,95.89 | LED3.6 55.28,95.89 44.32,95.89 | LED2.6 44.32,95.89
  Bottom 0.203: R8.2 43.31,80.01 43.31,96.46 LED2.6
BE  (via drill 0.35)
  Top 0.127: U6.13 64.39,75.44 65.79,74.04 76.58,74.04 | NANO.6 76.33,88.47 U5.13 76.33,74.04 76.45,74.04 76.58,74.04 | v81.79,68.58 81.79,69.34 80.77,70.36 80.77,72.84 79.57,74.04 76.58,74.04
  Bottom 0.127: 64.9,65.28 64.9,59.45 65.95,58.39 65.95,53.77 66.62,53.1 U3.36 | 64.9,65.28 | 64.9,65.28 64.9,65.63 65.69,66.42 79.09,66.42 81.25,68.58 v81.79,68.58
C  (via drill 0.35)
  Top 0.203: 35.31,84.96 31.99,84.96 LED1.4 29.26,80.79 R3.1 | 35.31,84.96 v40.77,84.96 | v41.78,84.96 v53.21,84.96 | v54.23,84.96 35.31,84.96
  Bottom 0.203: LED3.4 54.23,82.33 v54.23,84.96 v53.21,84.96 | LED2.4 v41.78,84.96 v40.77,84.96
C1  (via drill 0.35)
  Top 0.203: PIC.2 4.47,94.11 13.08,94.11 14.1,95.12 18.92,95.12 24.26,89.79 v26.72,89.79 v26.72,90.81
  Bottom 0.203: LED1.8 26.72,93.6 | 26.72,93.6 26.72,93.22 v26.72,90.81 | v26.72,89.79 26.72,83.95 | 26.72,83.95 LED1.3 | 26.72,83.95 26.72,93.6
C2  (via drill 0.35)
  Top 0.203: PIC.17 19.18,92.96 23.11,89.03 v39.24,89.03 v39.24,90.04
  Bottom 0.203: LED2.8 39.24,92.71 | 39.24,92.71 v39.24,90.04 | v39.24,89.03 39.24,87.88 | 39.24,87.88 LED2.3 | 39.24,87.88 39.24,92.71
C3  (via drill 0.35)
  Top 0.203: PIC.1 4.45,95.5 5.71,96.77 20.19,96.77 25.53,91.44 v51.79,91.44 v51.79,90.42
  Bottom 0.203: v51.79,91.44 LED3.8 51.79,82.42 | v51.79,90.42 51.79,82.42 | 51.79,82.42 LED3.3
CLOCK  (via drill 0.35)
  Top 0.127: U6.11 v66.93,76.33 | v78.87,76.33 U5.11 78.87,87.25 87.5,95.89 88.82,95.89 NANO.4
  Bottom 0.127: v66.93,76.33 v78.87,76.33
D  (via drill 0.35)
  Top 0.203: LED1.2 28.31,86.36 32,86.36 | 32,86.36 v35.69,86.36 | v36.7,86.36 v48.26,86.36 | v49.28,86.36 32,86.36 | LED2.2 37.47,82.23 39.69,80.01 R7.1
  Bottom 0.203: LED3.2 49.28,82.26 v49.28,86.36 v48.26,86.36 | LED2.2 v36.7,86.36 v35.69,86.36
D0
  Top 0.127: IC1.18 30.23,43.19 33.37,46.33 35.4,46.33 36.25,45.48 U2.33 52.53,45.48 53.43,44.58 55.61,44.58 56.68,45.65 63.74,45.65 63.91,45.48 U3.33 71.16,45.48 76.89,39.75 U4.17
  Bottom 0.127: NANO.20 71.04,80.64 61.72,80.64 51.18,70.1 51.18,47.04 U2.33
D1
  Top 0.127: IC1.17 30.23,40.65 33.37,43.79 35.4,43.79 36.25,42.94 U2.32 52.75,42.94 53.6,42.09 55.62,42.09 56.47,42.94 U3.32 71.15,42.94 75.61,38.48 U4.18
  Bottom 0.127: NANO.21 73.33,80.39 61.83,80.39 51.44,70 51.44,44.75 U2.32
D2
  Top 0.127: IC1.16 30.23,38.1 33.37,41.25 35.4,41.25 36.25,40.4 U2.31 52.75,40.4 53.6,39.55 55.62,39.55 56.52,40.45 69.85,40.45 U3.31 71.03,40.4 74.22,37.21 U4.19
  Bottom 0.127: NANO.22 77.37,81.84 75.67,80.14 61.93,80.14 51.69,69.89 51.69,42.47 U2.31
D3
  Top 0.127: IC1.15 30.23,35.56 33.37,38.71 35.4,38.71 36.25,37.86 U2.30 52.75,37.86 53.6,37.01 62.99,37.01 63.84,37.86 U3.30 71.15,37.86 73.07,35.94 U4.20
  Bottom 0.127: NANO.23 79.83,81.89 77.83,79.88 62.04,79.88 51.94,69.79 51.94,40.18 U2.30
D4
  Top 0.127: IC1.14 30.23,33.02 33.37,36.17 35.4,36.17 36.25,35.32 U2.29 52.75,35.32 53.6,34.47 55.62,34.47 56.47,35.32 U3.29 71.15,35.32 71.8,34.67 U4.21
  Bottom 0.127: U2.29 52.2,37.89 52.2,69.68 62.14,79.63 80.19,79.63 NANO.24
D5
  Top 0.127: IC1.13 30.23,30.48 33.37,33.63 35.4,33.63 36.25,32.78 U2.28 52.53,32.78 53.38,33.63 55.66,33.63 56.51,32.78 U3.28 69.64,32.77 81.72,32.77 84.13,30.35 86.71,30.35 86.82,30.46 86.82,35.74 86.61,35.94 U4.13
  Bottom 0.127: NANO.25 82.47,79.38 62.25,79.38 52.45,69.58 52.45,35.61 U2.28
D6
  Top 0.127: U4.14 86.61,37.21 87.07,36.75 87.07,30.36 86.81,30.1 83.98,30.1 82.46,31.62 72.64,31.62 71.26,30.24 U3.27 66.35,30.24 66.13,30.02 56.72,30.02 55.66,31.09 53.38,31.09 52.53,30.24 U2.27 43.76,30.24 42.12,31.88 33.08,31.88 31.88,30.67 31.88,29.96 30.23,28.3 IC1.12
  Bottom 0.127: U2.27 51.58,30.24 51.58,30.25 52.7,31.38 52.7,69.47 62.36,79.12 84.76,79.12 NANO.26
D7
  Top 0.127: IC1.11 32.13,27.05 32.13,30.57 33.19,31.62 39.86,31.62 43.78,27.7 U2.26 52.53,27.7 53.38,28.55 55.66,28.55 56.51,27.7 U3.26 71.13,27.7 73.66,30.23 82.7,30.23 84.1,28.83 86.81,28.83 87.33,29.34 87.33,29.67 87.63,29.97 87.63,37.57 86.72,38.48 U4.15
  Bottom 0.127: NANO.27 87.05,78.87 62.46,78.87 52.96,69.36 52.96,31.04 U2.26
DP
  Top 0.203: LED1.5 31.87,82.3 32.13,82.57 | 32.13,82.57 31.69,82.12 33.8,80.01 R5.1 | 32.13,82.57 33.26,83.69 44.32,83.69 | LED3.5 55.41,83.69 44.32,83.69 | LED2.5 44.32,83.69
DS
  Top 0.127: NANO.8 73.66,90.88 73.66,81.41 75.06,80.01 U5.14
E  (via drill 0.35)
  Top 0.203: 29.34,87.5 27.05,87.5 26.91,87.5 LED1.1 21.64,82.11 22.27,81.48 R1.1 | 29.34,87.5 v33.02,87.5 | v34.16,87.5 v45.59,87.5 | v46.74,87.5 29.34,87.5
  Bottom 0.203: LED3.1 46.71,87.48 v46.74,87.5 v45.59,87.5 | LED2.1 v34.16,87.5 v33.02,87.5
F  (via drill 0.35)
  Top 0.203: LED1.9 28.18,93.47 31.24,93.47 | 31.24,93.47 v35.69,93.47 | v36.7,93.47 v48.26,93.47 | v49.28,93.47 31.24,93.47
  Bottom 0.203: LED3.9 49.28,97.45 v49.28,93.47 v48.26,93.47 | LED2.9 v36.7,93.47 v35.69,93.47 | R2.1 25.37,96.28 LED1.9
G  (via drill 0.35)
  Top 0.203: LED1.10 27.04,92.08 28.19,92.08 | 28.19,92.08 v33.02,92.08 | v34.16,92.08 v45.59,92.08 | v46.74,92.08 28.19,92.08
  Bottom 0.203: LED3.10 46.71,92.1 v46.74,92.08 v45.59,92.08 | LED2.10 v34.16,92.08 v33.02,92.08 30.73,89.79 30.73,80.52 31.24,80.01 R4.2
GND  (via drill 0.35)
  Top 0.254: U4.16 v84.22,39.75 | U6.8 v69.47,73.38 | U5.8 v81.41,73.38 | U7.7 v80.36,51.03 | U9.1 v91.73,41.07 | U9.8 v91.73,32.18 | U9.15 v94.83,39.8 | U8.5 v91.73,53.69 | U8.7 v91.73,51.15 | U8.11 v94.83,54.96 | U8.9 v94.83,52.42 | U10.8 v91.73,15.24 | R14.1 v87.63,5.33 | C9.2 96.47,46.46 v96.48,46.47 | C10.2 v96.39,29.23 v96.4,29.24 | C4.2 81.54,18.54 v81.56,18.56 | U4.2 v84.13,21.96 | C7.2 85.02,64.06 v85.04,64.08 | C13.2 v92.84,64.14 | C8.2 v96.39,64.14 | v47.5,54.36 58.29,54.36 59.05,53.59 v59.56,53.59 v63.5,53.59 66.17,53.59 v66.55,53.98 | v47.5,51.82 57.02,51.82 v57.28,51.56 v59.44,51.56 v66.42,51.56 | v47.62,44.2 47.75,44.07 v58.42,44.07 61.47,44.07 62.48,45.09 v63.5,45.09 66.42,45.09 v66.67,44.83 | v47.62,39.12 56.52,39.12 57.15,39.75 v58.42,39.75 v63.12,39.75 v63.13,39.76 63.67,39.76 63.68,39.75 v66.8,39.75 | v47.75,34.04 47.87,34.15 58.15,34.15 v58.17,34.16 v63.12,34.16 v65.66,34.16 | v47.75,31.5 58.29,31.5 v58.42,31.37 59.2,30.59 v62.98,30.59 65.9,30.59 v65.91,30.61 | v59.18,20.07 65.21,20.07 | 65.21,20.07 v65.91,20.77 | v59.18,23.11 65.15,23.11 v65.91,23.88 | 65.21,20.07 65.77,19.51 v66.42,19.51
  Top 0.61: U$5.P$8 U$5.P$7 | U$5.P$7 U$5.P$9 | U$5.P$9 U$5.P$10 | U$5.P$10 U$5.P$8 | U$5.P$8 U$5.P$9 | U$5.P$7 U$5.P$10
  Bottom 0.508: 93.09,76.2 93.09,75.44 C12.- 93.47,79.5 93.6,79.63 93.34,79.88 88.69,79.88 86.71,77.9 86.64,77.9 | 93.09,76.2 93.09,76.83 | 93.09,76.2 93.09,73.4 93.14,73.34 | 86.64,77.9 84.03,77.9 83.93,77.8 83.97,77.84 83.97,78.36 87.17,78.36 87.52,78.71 88.15,79.34 88.51,79.34 88.51,79.26 87.22,77.97 87.15,77.9 86.64,77.9 | 86.64,77.9 84.88,77.9 84.36,78.42 84.37,78.42 87.1,78.42
  other vias: 51.44,71.75 52.45,72.9 53.59,74.04 54.74,75.06 56.64,71.63 57.53,72.77 58.17,73.66
  pour Bottom: 0.23,69.22 0.23,0.23 99.77,0.23 99.77,69.22
  pour Bottom: 0.25,99.59 0.25,70.87 84.45,70.87 84.45,79.12 99.57,79.12 99.57,79.25 99.82,78.99 99.82,99.72 96.49,99.72
  pour Bottom: 93.34,79.63 93.34,68.33 93.47,68.33 93.47,79.63
  pour Top: 50.16,71.63 54.23,75.69 54.36,75.69 55.5,75.69 56.9,75.69 58.55,74.04 58.55,72.64 58.42,72.52 57.02,71.12 56.39,71.12 56.26,70.99 50.67,70.99 50.16,71.5
LATCH  (via drill 0.35)
  Top 0.127: U6.12 v65.66,75.95 | v77.6,75.69 U5.12 77.6,79.38 78.61,80.39 78.61,88.21 NANO.5
  Bottom 0.127: v65.66,75.95 65.66,75.72 77.56,75.72 v77.6,75.69
LCD_D4
  Top 0.127: U1.6 6.22,53.45 6.22,62.91 8.96,65.64 18.02,65.64 U$5.P$11
LCD_D5
  Top 0.127: U1.7 6.48,51.17 6.48,62.75 9.11,65.39 19.54,65.39 20.73,66.58 20.73,68.33 | 20.73,68.33 20.73,68.45 | 20.73,68.45 20.73,68.49 | 20.73,68.49 20.73,68.45 | U$5.P$12 20.73,68.49 | 20.73,68.49 20.73,68.33
LCD_D6
  Top 0.127: U1.8 6.73,48.88 6.73,62.6 9.26,65.13 20.04,65.13 U$5.P$13
LCD_D7
  Top 0.127: U1.9 6.99,46.6 6.99,62.46 9.39,64.87 21.57,64.87 23.24,66.55 23.24,68.52 U$5.P$14
LCD_E
  Top 0.127: U1.5 5.97,55.74 5.97,63.06 8.82,65.91 12.45,65.91 13.21,66.67 13.21,68.39 U$5.P$6
LCD_RS
  Top 0.127: U1.3 4.33,58.18 5.46,59.31 5.46,68.07 5.84,68.45 8.13,68.45 U$5.P$4
LCD_RW
  Top 0.127: U1.4 5.71,58.03 5.71,63.22 8.66,66.17 10.92,66.17 U$5.P$5
LCDA
  Top 0.254: 27.72,67.15 R10.2 27.72,67.15 | 27.72,67.15 U$5.P$15
MEMCE
  Top 0.127: U4.30 80.14,23.24 86.23,17.14 91.19,17.14 92.71,18.67 92.71,33.27 91.26,34.72 U9.6
N$1
  Top 0.127: P1.S 88.62,73.84 88.62,58.19 89.31,57.5 U8.2 U8.3
N$2
  Top 0.127: U7.11 90.08,54.84 U8.4
N$3
  Top 0.127: IC1.2 18.58,45.47 U1.33
N$4
  Top 0.127: P1.E 89.76,58.96 89.95,58.77 U8.1 90.97,58.77 C13.1
N$5
  Top 0.127: IC1.3 18.58,42.93 U1.32
N$6
  Top 0.127: IC1.4 18.58,40.39 U1.31
N$7
  Top 0.127: IC1.5 18.58,37.85 U1.30
N$8
  Top 0.127: IC1.6 18.58,35.31 U1.29
N$9  (via drill 0.35)
  Top 0.127: U6.14 v63.12,75.44 | U5.9 v81.41,75.18
  Bottom 0.127: v63.12,75.44 63.12,75.37 73.39,75.37 73.64,75.12 81.35,75.12 v81.41,75.18
N$10
  Top 0.203: R7.2 36.13,77.17 14.83,77.17 12.83,79.17 12.83,80.52 11.81,81.53 5.84,81.53 4.57,82.8 PIC.6
N$11
  Top 0.203: PIC.7 4.57,80.26 5.97,78.87 12.19,78.87 14.55,76.5 30.58,76.5 R5.2
N$12
  Top 0.203: PIC.8 4.7,77.72 5.97,76.45 13.59,76.45 14.2,75.84 25.02,75.84 R3.2
N$13
  Top 0.203: PIC.9 8.64,75.18 9.65,74.17 13.21,74.17 14.22,75.18 20.07,75.18 22.27,72.98 R1.2
N$14
  Top 0.203: PIC.10 11.28,75.51 22.25,75.51 R2.2
N$15
  Top 0.203: R4.1 27.8,76.17 14.34,76.17 12.79,77.72 PIC.11
N$16
  Top 0.203: PIC.12 11.26,80.26 14.69,76.83 33.35,76.83 R6.1
N$17
  Top 0.203: PIC.13 12.19,82.8 13.16,81.84 13.16,79.3 14.96,77.5 38.91,77.5 R8.1
N$18
  Top 0.127: C5.1 15.49,87.68 Q1.2 12.75,90.42 PIC.16
N$19
  Top 0.127: C6.1 18.41,84.61 Q1.1 15.95,82.88 PIC.15
N$20
  Bottom 0.406: R9.2 3.39,87.82 PIC.4
N$21
  Top 0.127: P2.S 16.89,72.9 15.49,71.5 11.43,71.5 10.67,70.74 10.67,68.45 U$5.P$3
N$22
  Top 0.127: IC1.7 18.58,32.77 U1.28
N$23
  Top 0.127: IC1.8 18.58,30.23 U1.27
N$24
  Bottom 1.27: U3.2 56.8,60.72 R11.2
N$25
  Top 0.127: R13.1 90.04,2.1 SW1.3 SW1.4
  Top 0.254: R14.2 R13.1
N$26
  Top 0.254: R13.2 R12.1 90.87,6.29 91.69,7.11 C11.2
N$27
  Top 0.127: IC1.9 18.58,27.69 U1.26
PB0
  Top 0.127: U1.10 3.33,40.39 | 3.33,40.39 3.33,40.16 1.05,37.88 1.05,22.14 1.88,21.31 3.96,21.31 6.41,18.86 6.41,7.81 4.95,6.35 4.95,4.05 6.72,2.29 21.14,2.29 CIA_PB.2 | U2.2 32.35,60.72 28.45,64.62 9.56,64.62 7.24,62.3 7.24,44.3 3.33,40.39
PB1  (via drill 0.35)
  Top 0.127: CIA_PB.3 18.86,2.54 9,2.54 7.05,4.5 7.05,20.77 3.89,23.93 1.93,23.93 1.31,24.55 1.31,35.84 U1.11 7.62,42.15 7.62,54.86 9.91,57.15 v13.91,57.15 | v15.55,57.15 32.89,57.15 33.92,58.18 U2.3
  Bottom 0.127: v15.55,57.15 v13.91,57.15
PB2  (via drill 0.35)
  Top 0.127: CIA_PB.4 16.57,2.79 11.29,2.79 9.91,4.18 9.91,20.44 3.96,26.39 2.26,26.39 1.56,27.09 1.56,33.55 U1.12 7.87,39.87 7.87,52.58 9.65,54.36 v13.64,54.36 | v15.6,54.36 32.59,54.36 33.88,55.64 U2.4
  Bottom 0.127: v13.64,54.36 v15.6,54.36
PB3  (via drill 0.35)
  Top 0.127: CIA_PB.5 14.29,3.05 13.34,3.05 12.45,3.94 12.45,20.44 4.01,28.88 2.82,28.88 1.82,29.89 1.82,31.27 U1.13 8.13,37.58 8.13,50.16 9.78,51.82 v13.65,51.82 | U2.5 34.05,53.1 32.77,51.82 v15.55,51.82
  Bottom 0.127: v15.55,51.82 v13.65,51.82
PB4
  Top 0.127: CIA_PB.6 13.72,19.85 U1.14
PB5
  Top 0.127: CIA_PB.7 11.18,19.85 U1.15
PB6
  Top 0.127: CIA_PB.8 8.64,19.85 U1.16
PB7
  Top 0.127: CIA_PB.9 6.1,7.13 6.67,7.7 6.67,19.28 U1.17
PHI2  (via drill 0.35)
  Top 0.127: U7.9 81.56,52.3 80.9,52.96 76.07,52.96 73.39,55.64 U3.37 69.84,55.63 68.71,55.63 67.37,54.29 67.37,50.63 65.64,48.9 58.04,48.9 56.29,47.14 33.38,47.14 31.15,49.37 25.11,49.37 24.64,48.9 24.64,21.86 | 24.64,21.86 25.15,21.86 26.04,21.86 28.81,21.86 32.38,25.44 32.38,30.46 33.29,31.37 37.68,31.37 43.89,25.16 U2.25 | v15.55,25.15 15.57,25.16 U1.25 19.84,25.16 23.13,21.86 24.64,21.86
  Bottom 0.127: v15.55,25.15 11.05,25.15 4.69,18.79 1.84,18.79 0.83,19.81 0.83,87.92 PIC.3
R/W  (via drill 0.35)
  Top 0.127: 50.67,23.88 43.94,23.88 36.7,31.11 33.4,31.11 32.64,30.36 32.64,22.23 33.66,21.21 35.31,21.21 36.07,20.45 36.07,17.02 35.7,16.65 33.05,16.65 32.16,17.54 23.8,17.54 | 50.67,23.88 50.74,23.81 51.05,23.5 51.44,23.11 51.44,21.84 50.8,21.21 48.13,21.21 47.5,20.57 47.5,18.16 48.13,17.53 48.15,17.54 U2.22 | v23.82,22.43 24.24,22.86 24.24,46.49 22.73,48.01 IC1.1 | 50.67,23.88 53.21,26.42 59.56,26.42 v59.61,26.37 | v59.76,48.33 60.07,48.64 65.66,48.64 66.28,48.02 U3.34 86.09,48.02 93.47,40.64 93.47,39.5 95.71,37.26 U9.13 96.4,37.21 v97.79,37.21 | U1.22 23.8,17.54 | v23.82,20.49 23.82,17.55 23.8,17.54
  Bottom 0.127: v23.82,22.43 v23.82,20.49 | v23.82,20.49 | NANO.30 97.69,81.51 98.55,80.64 98.55,70.87 98.55,58.42 97.79,57.66 v97.79,37.21 | v59.76,48.33 59.76,26.52 v59.61,26.37
RESET  (via drill 0.35)
  Top 0.127: R12.2 90.36,8.64 v92.33,8.64 | v98.55,57.53 98.52,57.5 U8.13
  Bottom 0.127: v92.33,8.64 97.54,8.64 99.06,10.16 99.06,57.02 v98.55,57.53 98.81,57.78 98.81,71.22 98.81,82.3 98.04,83.06 96.32,83.06 NANO.29
SERCLK
  Top 0.127: U2.18 32.87,21.59 16.87,21.59 14.73,23.73 14.73,58.06 16.36,59.69 20.19,59.69 20.83,60.33 20.83,62.61 20.18,63.26 U1.40
SERDAT
  Top 0.127: U1.39 17.03,60.72 14.48,58.17 14.48,23.62 16.76,21.34 30.59,21.34 U2.19
TOD
  Bottom 0.127: NANO.1 95.39,99.43 2.02,99.43 0.57,97.98 0.57,18.73 1.76,17.54 U1.19
VCC  (via drill 0.35)
  Top 0.254: C7.1 84.99,60.65 84.99,60.58 U7.14 U7.13 U7.2 | U8.14 96.36,60.61 C8.1 99.23,60.65 99.29,60.71 | U9.16 96.47,41.18 C9.1 96.51,43.31 99.29,43.31 | U10.16 96.39,24.17 C10.1 96.45,26.16 99.29,26.16 | v5.84,16.38 0.71,16.38 0.71,16.65 0.64,16.73 0.64,68.71 1.62,69.69 U$5.P$2 10.41,73.28 P2.E | U4.32 78.41,18.59 | 78.41,18.59 C4.1 | v58.8,62.23 58.8,65.79 58.8,67.18 | 58.8,67.18 R10.1 | 58.8,67.18 | U7.2 U7.1 | U7.2 U7.3 U7.4 | 67.56,63.88 68.71,65.02 83.31,65.02 | 67.56,63.88 67.56,59.44 68.82,58.18 U3.38 | U3.8 53.44,46.65 v27.89,46.65 v27.89,46.64 | v78.36,13.4 C4.1 78.41,18.59 | 79.63,0.71 79.63,6.86 78.36,8.13 v78.36,12 | U2.24 48.4,22.62 44.07,18.29 v44.07,16.95 | v44.07,15.81 40.83,12.57 v36.7,12.57 | U7.10 87.23,53.57 87.74,53.06 99.29,53.06 | 58.8,67.18 64.26,67.18 67.56,63.88
  Top 0.406: NANO.12 68.12,95.5 61.72,95.5 59.56,97.66 | 59.56,97.66 59.56,99.29 | 59.56,99.29 99.06,99.29 99.29,99.06 99.29,84.68 | 99.29,84.68 99.29,80.64 | 99.29,80.64 99.29,79.76 99.29,75.06 | 99.29,75.06 99.29,60.71 | 99.29,43.31 99.29,38.61 | 99.29,38.61 99.29,26.16 99.29,7.47 99.29,7.21 | C11.1 99.19,7.11 99.29,7.21 | 99.29,7.21 99.29,6.4 | 99.29,6.4 SW1.2 SW1.1 | 99.29,6.4 99.29,0.86 99.14,0.71 79.63,0.71 75.06,0.71 74.68,0.71 | 74.68,0.71 72.39,0.71 72.14,0.71 | 72.14,0.71 69.72,0.71 69.6,0.71 | 69.6,0.71 38.73,0.71 29.46,0.71 | 29.46,0.71 1.02,0.71 0.71,1.02 0.71,4.95 | 0.71,4.95 3.49,4.95 CIA_PB.10 | 69.6,0.71 VCC.1 VCC.2 | VCC.2 72.17,4.73 72.2,4.76 VCC.3 74.68,0.71 | VCC.2 72.13,0.72 72.14,0.71 | 0.71,4.95 0.71,13.84 0.71,16.38 | 59.56,99.29 4.17,99.29 1.35,96.47 1.35,92.63 2.29,91.69 6.22,91.69 7.39,90.53 7.39,88.9 PIC.14 | v36.7,12.57 32.13,12.57 29.46,9.91 29.46,0.71 | 99.29,75.06 C12.+ 93.73,77.34 86.61,77.34 85.98,76.71 85.98,67.69 83.31,65.02 83.31,61.09 83.82,60.58 84.99,60.58 | 99.29,80.64 83.31,80.64 81.53,80.64 80.14,79.25 U5.10 | U6.16 60.58,80.01 | 60.58,80.01 60.58,96.65 59.56,97.66 | 60.58,80.01 67.69,80.01 68.2,80.01 | 68.2,80.01 U6.10 | 68.2,80.01 72.01,80.01 72.52,79.5 U5.16 | 99.29,38.61 99.29,52.96 99.29,53.06 99.29,84.68
  Bottom 0.254: v5.84,16.38 C1.1 | v58.8,62.23 58.72,62.15 R11.1 58.36,60.38 58.36,58.17 58.36,47.31 56.71,45.66 C3.1 | v27.89,46.64 27.87,46.66 C14.1 | v78.36,12 v78.36,13.4 | v44.07,16.95 v44.07,15.81
  Bottom 0.406: v36.7,12.57 36.7,14.98 C2.1 | PIC.14 7.69,85.34 R9.1
  Bottom 1.27: U1.20 C1.1 | U2.20 34.4,14.99 C2.1 | U3.8 54.4,45.47 C3.1 | IC1.20 C14.1
VIN
  Top 0.61: J1.3 89.71,85.85 92.84,85.85 96.39,89.41 96.39,97.54 95.38,98.55 63.55,98.55 NANO.15
VPB4
  Top 0.127: U$4.4 U$4.3
  Bottom 0.127: U2.14 40.79,23.83 40.79,11.66 42.92,9.53 57.4,9.53 U$4.4
VPB5
  Top 0.127: U$3.4 U$3.3
  Bottom 0.127: U$3.4 48.17,9.27 42.8,9.27 40.53,11.54 40.53,21.55 U2.15
VPB6
  Top 0.127: U$2.4 U$2.3
  Bottom 0.127: U2.16 40.28,19.26 40.28,7.68 U$2.4
VPB7
  Top 0.127: U$1.4 U$1.3
  Bottom 0.127: U$1.3 40.01,10.88 40.01,17 U2.17

### Text on the board
tPlace: V 7 6 5 4 3 2 1 0 G
tNames: UP DOWN OK CANCEL